# Altium project Apalis Evaluation Board.PrjPCB (part 4 of 5)

## Sheet USB_Connectors.SchDoc: Apalis Evaluation Board 1.1
size A3; Organization: Toradex AG; Address1: Altsagenstrasse 5; Address2: Horw; Address3: 6048; Address4: Switzerland; DocumentNumber: 7; Revision: V1.1; SheetNumber: 7; SheetTotal: 32; PageSetup: Record=PageOptions|CenterHorizontal=True|CenterVertical=True|PrintScale=0.71|XCorrection=1.00|YCorrection=1.00|PrintKind=0|BorderSize=5000000|LeftOffset=0|BottomOffset=0|Orientation=2|PaperLength=1000|PaperWidth=1000|Scale=100|PaperSource=7|PrintQuality=-4|MediaType=1|DitherType=10|PaperKind=A4|PrintScaleMode=1
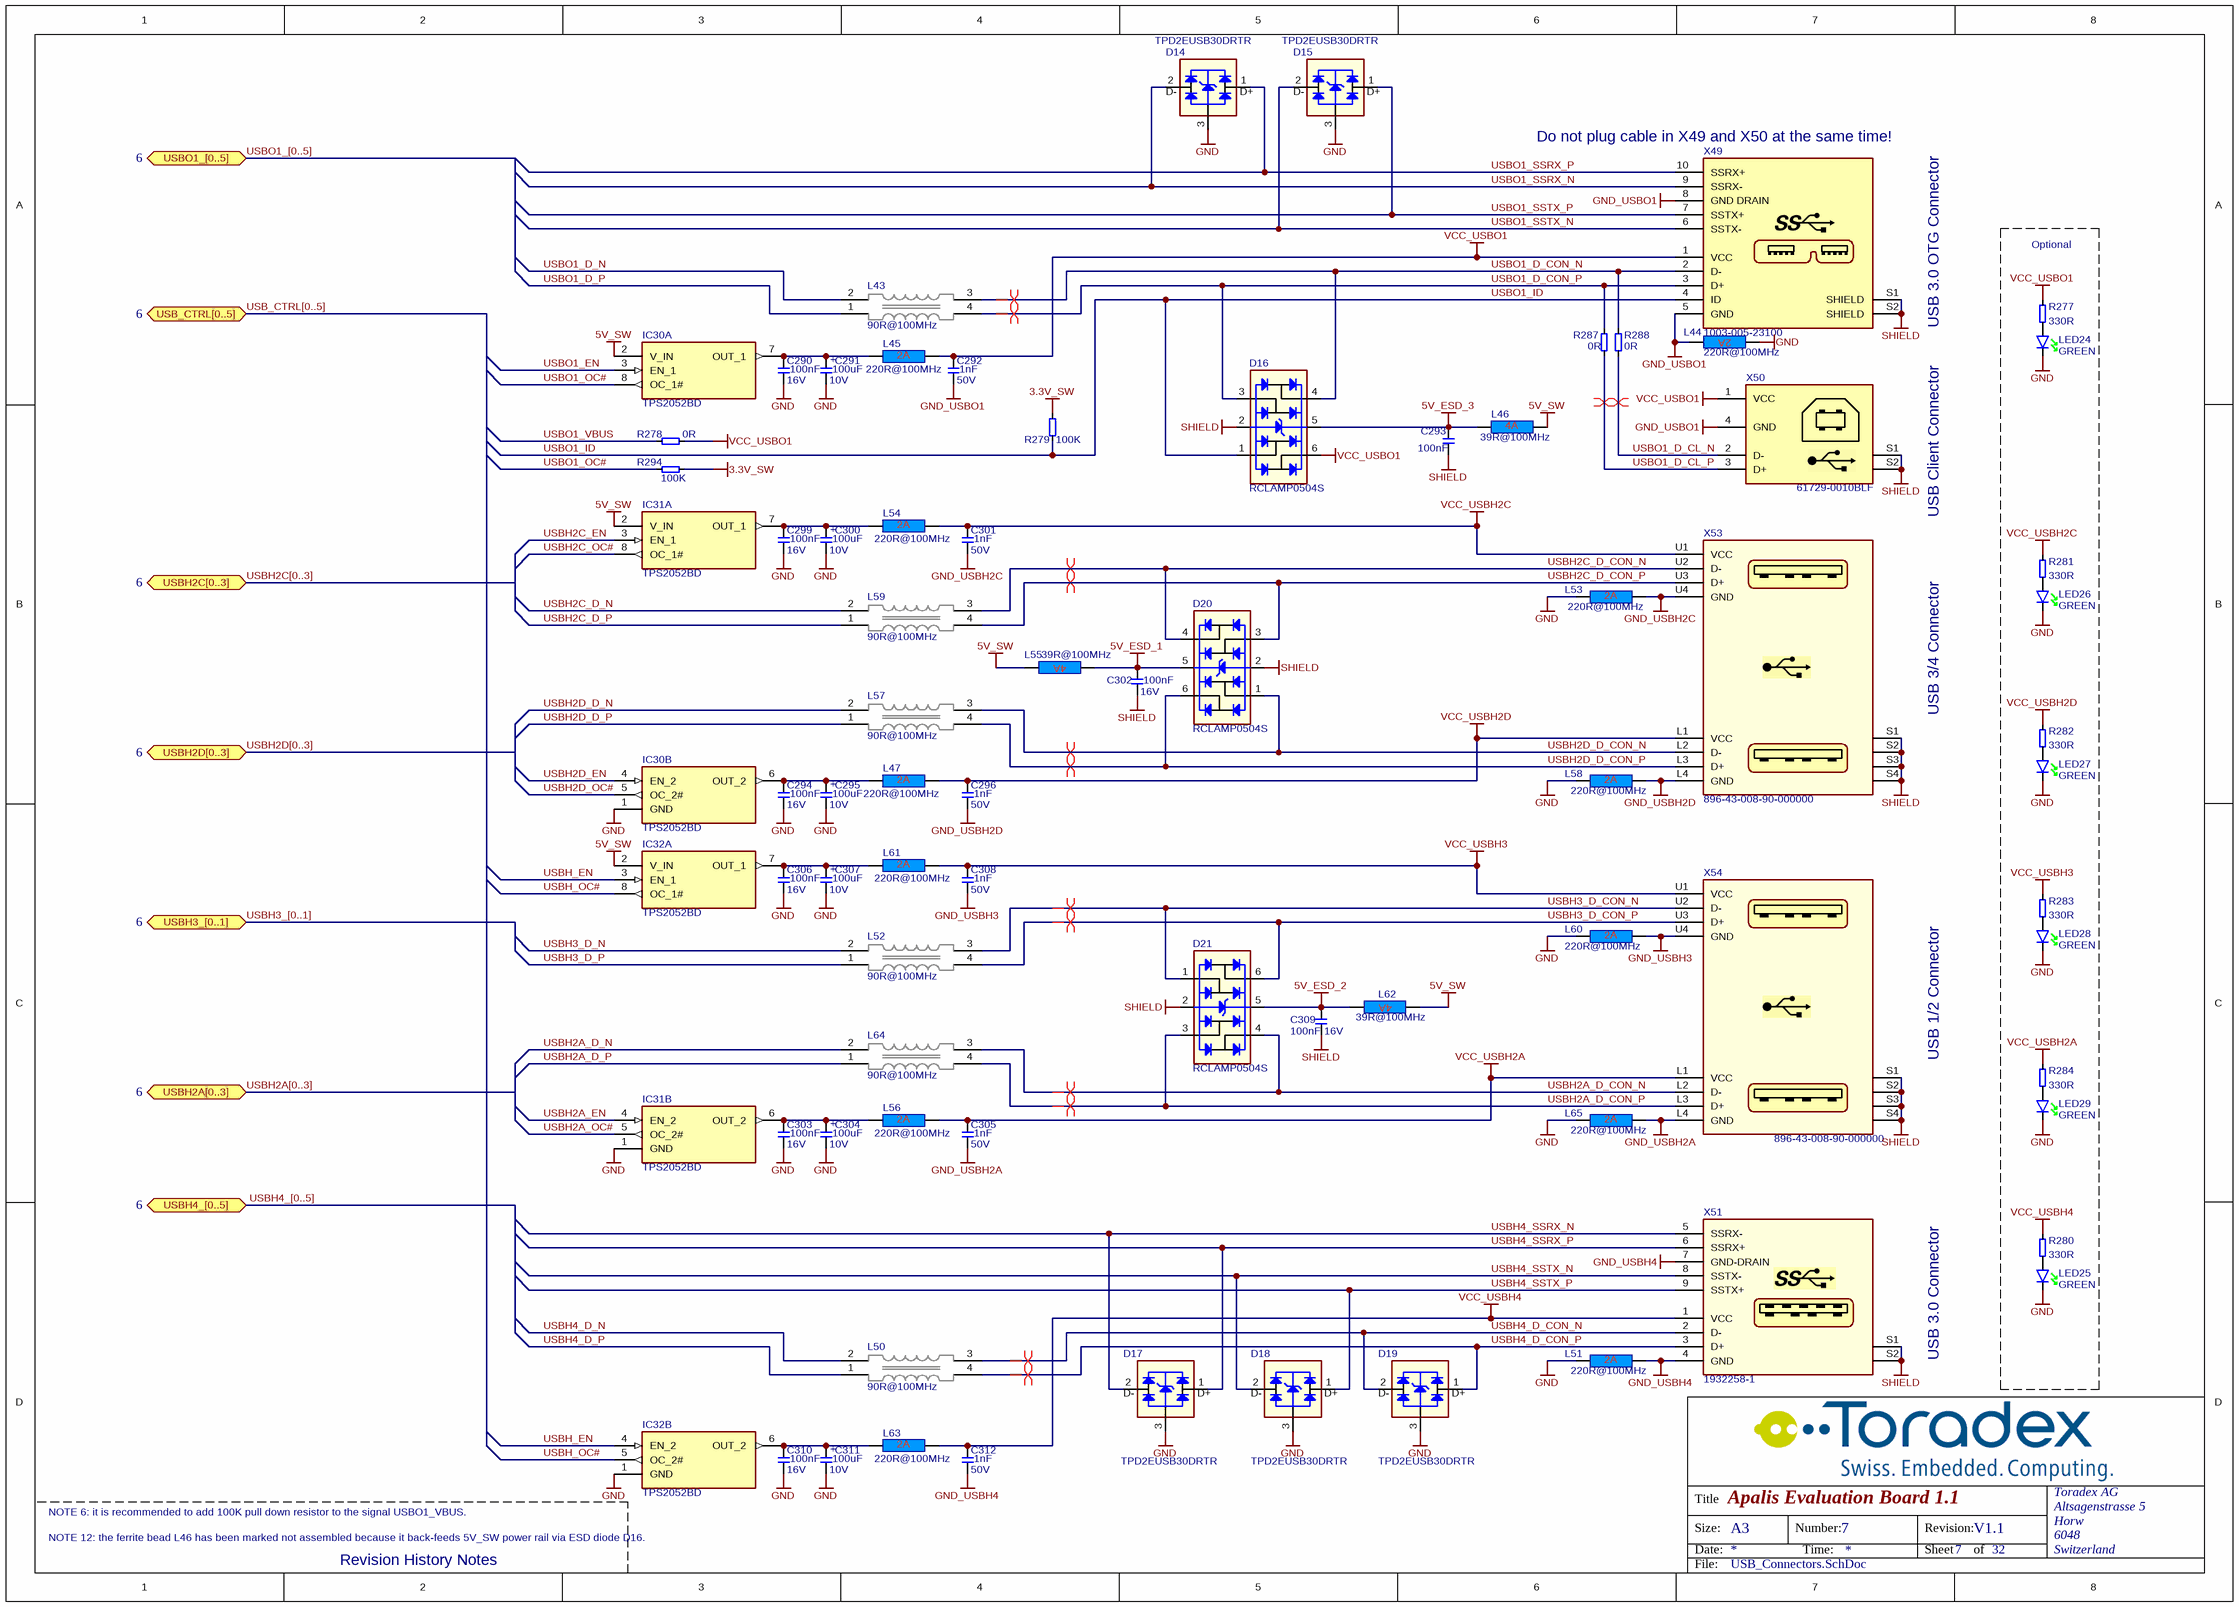
[diagram p21: USB_Connectors.SchDoc]

### Parts
C290  Rating: 16V  [T_CAPC0603X33N]  (hidden comment: 100nF)
C291  Rating: 10V  [CAPMP6032X280N]  (hidden comment: 100uF)
C292  Rating: 50V  [T_CAPC0603X33N]  (hidden comment: 1nF)
C293  100nF  [T_CAPC0603X33N]
C294  Rating: 16V  [T_CAPC0603X33N]  (hidden comment: 100nF)
C295  Rating: 10V  [CAPMP6032X280N]  (hidden comment: 100uF)
C296  Rating: 50V  [T_CAPC0603X33N]  (hidden comment: 1nF)
C299  Rating: 16V  [T_CAPC0603X33N]  (hidden comment: 100nF)
C300  Rating: 10V  [CAPMP6032X280N]  (hidden comment: 100uF)
C301  Rating: 50V  [T_CAPC0603X33N]  (hidden comment: 1nF)
C302  Rating: 16V  [T_CAPC0603X33N]  (hidden comment: 100nF)
C303  Rating: 16V  [T_CAPC0603X33N]  (hidden comment: 100nF)
C304  Rating: 10V  [CAPMP6032X280N]  (hidden comment: 100uF)
C305  Rating: 50V  [T_CAPC0603X33N]  (hidden comment: 1nF)
C306  Rating: 16V  [T_CAPC0603X33N]  (hidden comment: 100nF)
C307  Rating: 10V  [CAPMP6032X280N]  (hidden comment: 100uF)
C308  Rating: 50V  [T_CAPC0603X33N]  (hidden comment: 1nF)
C309  Rating: 16V  [T_CAPC0603X33N]  (hidden comment: 100nF)
C310  Rating: 16V  [T_CAPC0603X33N]  (hidden comment: 100nF)
C311  Rating: 10V  [CAPMP6032X280N]  (hidden comment: 100uF)
C312  Rating: 50V  [T_CAPC0603X33N]  (hidden comment: 1nF)
D14  TPD2EUSB30DRTR  [T_TI_TPD2EUSB30DRTR]
D15  TPD2EUSB30DRTR  [T_TI_TPD2EUSB30DRTR]
D16  RCLAMP0504S  [T_SOT95P285X90-6N]
D17  TPD2EUSB30DRTR  [T_TI_TPD2EUSB30DRTR]
D18  TPD2EUSB30DRTR  [T_TI_TPD2EUSB30DRTR]
D19  TPD2EUSB30DRTR  [T_TI_TPD2EUSB30DRTR]
D20  RCLAMP0504S  [T_SOT95P285X90-6N]
D21  RCLAMP0504S  [T_SOT95P285X90-6N]
IC30  TPS2052BD  [SOIC127P600X173-8N]  (parts A,B of 2)
IC31  TPS2052BD  [SOIC127P600X173-8N]  (parts A,B of 2)
IC32  TPS2052BD  [SOIC127P600X173-8N]  (parts A,B of 2)
L43  90R@100MHz  [T_Murata_DLW21SN900SQ2]
L44  220R@100MHz  [INDC1608X95N]
L45  220R@100MHz  [INDC1608X95N]
L46  39R@100MHz  [INDC2013X130N]
L47  220R@100MHz  [INDC1608X95N]
L50  90R@100MHz  [T_Murata_DLW21SN900SQ2]
L51  220R@100MHz  [INDC1608X95N]
L52  90R@100MHz  [T_Murata_DLW21SN900SQ2]
L53  220R@100MHz  [INDC1608X95N]
L54  220R@100MHz  [INDC1608X95N]
L55  39R@100MHz  [INDC2013X130N]
L56  220R@100MHz  [INDC1608X95N]
L57  90R@100MHz  [T_Murata_DLW21SN900SQ2]
L58  220R@100MHz  [INDC1608X95N]
L59  90R@100MHz  [T_Murata_DLW21SN900SQ2]
L60  220R@100MHz  [INDC1608X95N]
L61  220R@100MHz  [INDC1608X95N]
L62  39R@100MHz  [INDC2013X130N]
L63  220R@100MHz  [INDC1608X95N]
L64  90R@100MHz  [T_Murata_DLW21SN900SQ2]
L65  220R@100MHz  [INDC1608X95N]
LED24  Color: GREEN  [T_Osram_T670_GREEN]  (hidden comment: LG T670-K1L2-1)
LED25  Color: GREEN  [T_Osram_T670_GREEN]  (hidden comment: LG T670-K1L2-1)
LED26  Color: GREEN  [T_Osram_T670_GREEN]  (hidden comment: LG T670-K1L2-1)
LED27  Color: GREEN  [T_Osram_T670_GREEN]  (hidden comment: LG T670-K1L2-1)
LED28  Color: GREEN  [T_Osram_T670_GREEN]  (hidden comment: LG T670-K1L2-1)
LED29  Color: GREEN  [T_Osram_T670_GREEN]  (hidden comment: LG T670-K1L2-1)
R277  330R  [T_RESC0603X30N]
R278  0R  [T_RESC0603X30N]
R279  100K  [t_RESC0603X30N]
R280  330R  [T_RESC0603X30N]
R281  330R  [T_RESC0603X30N]
R282  330R  [T_RESC0603X30N]
R283  330R  [T_RESC0603X30N]
R284  330R  [T_RESC0603X30N]
R287  0R  [RESC1005X40N]
R288  0R  [RESC1005X40N]
R294  100K  [t_RESC0603X30N]
X49  1003-005-23100  [T_Cnc_1003-005-23100]
X50  61729-0010BLF  [T_FCI_61729-0010BLF]
X51  1932258-1  [T_TE_1932258-1]
X53  896-43-008-90-000000  [T_MMMC_896-43-008-90-000000]
X54  896-43-008-90-000000  [T_MMMC_896-43-008-90-000000]

### Blocks framed on the sheet
Optional: LED24-LED29 R277 R280-R284

### Ports
USB_CTRL[0..5] (bidir, see 6), USBH2A[0..3] (bidir, see 6), USBH2C[0..3] (bidir, see 6), USBH2D[0..3] (bidir, see 6), USBH3_[0..1] (bidir, see 6), USBH4_[0..5] (bidir, see 6), USBO1_[0..5] (bidir, see 6)

### Nets
3.3V_SW: R279.1 R294.2
5V_ESD_1: C302.2 D20.5 L55.1
5V_ESD_2: C309.2 D21.5 L62.2
5V_ESD_3: C293.2 D16.5 L46.1
5V_SW: IC30.2(V_IN) IC31.2(V_IN) IC32.2(V_IN) L46.2 L55.2 L62.1
GND: C290.1 C291.2 C294.1 C295.2 C299.1 C300.2 C303.1 C304.2 C306.1 C307.2 C310.1 C311.2 D14.3 D15.3 D17.3 D18.3 D19.3 IC30.1(GND) IC31.1(GND) IC32.1(GND) L44.1 L51.1 L53.1 L58.1 L60.1 L65.1 LED24.K LED25.K LED26.K LED27.K LED28.K LED29.K
GND_USBH2A: C305.1 L65.2 X54.L4(GND)
GND_USBH2C: C301.1 L53.2 X53.U4(GND)
GND_USBH2D: C296.1 L58.2 X53.L4(GND)
GND_USBH3: C308.1 L60.2 X54.U4(GND)
GND_USBH4: C312.1 L51.2 X51.4(GND) X51.7(GND-DRAIN)
GND_USBO1: C292.1 L44.2 X49.5(GND) X49.8(GND_DRAIN) X50.4(GND)
SHIELD: C293.1 C302.1 C309.1 D16.2 D20.2 D21.2 X49.S1(SHIELD) X49.S2(SHIELD) X50.S1 X50.S2 X51.S1(SHIELD) X51.S2(SHIELD) X53.S1(SHIELD) X53.S2(SHIELD) X53.S3(SHIELD) X53.S4(SHIELD) X54.S1(SHIELD) X54.S2(SHIELD) X54.S3(SHIELD) X54.S4(SHIELD)
VCC_USBH2A: C305.2 L56.2 R284.2 X54.L1(VCC)
VCC_USBH2C: C301.2 L54.2 R281.2 X53.U1(VCC)
VCC_USBH2D: C296.2 L47.2 R282.2 X53.L1(VCC)
VCC_USBH3: C308.2 L61.2 R283.2 X54.U1(VCC)
VCC_USBH4: C312.2 L63.2 R280.2 X51.1(VCC)
VCC_USBO1: C292.2 D16.6 L45.2 R277.2 R278.2 X49.1(VCC) X50.1(VCC)
USBH2A_D_CON_N: D21.4 L64.3 X54.L2(D-)
USBH2A_D_CON_P: D21.3 L64.4 X54.L3(D+)
USBH2A_D_N: L64.2
USBH2A_D_P: L64.1
USBH2A_EN: IC31.4(EN_2)
USBH2A_OC#: IC31.5(OC_2#)
USBH2C_D_CON_N: D20.4 L59.3 X53.U2(D-)
USBH2C_D_CON_P: D20.3 L59.4 X53.U3(D+)
USBH2C_D_N: L59.2
USBH2C_D_P: L59.1
USBH2C_EN: IC31.3(EN_1)
USBH2C_OC#: IC31.8(OC_1#)
USBH2D_D_CON_N: D20.1 L57.3 X53.L2(D-)
USBH2D_D_CON_P: D20.6 L57.4 X53.L3(D+)
USBH2D_D_N: L57.2
USBH2D_D_P: L57.1
USBH2D_EN: IC30.4(EN_2)
USBH2D_OC#: IC30.5(OC_2#)
USBH3_D_CON_N: D21.1 L52.3 X54.U2(D-)
USBH3_D_CON_P: D21.6 L52.4 X54.U3(D+)
USBH3_D_N: L52.2
USBH3_D_P: L52.1
USBH4_D_CON_N: D19.2(D-) L50.3 X51.2(D-)
USBH4_D_CON_P: D19.1(D+) L50.4 X51.3(D+)
USBH4_D_N: L50.2
USBH4_D_P: L50.1
USBH4_SSRX_N: D17.2(D-) X51.5(SSRX-)
USBH4_SSRX_P: D17.1(D+) X51.6(SSRX+)
USBH4_SSTX_N: D18.2(D-) X51.8(SSTX-)
USBH4_SSTX_P: D18.1(D+) X51.9(SSTX+)
USBH_EN: IC32.3(EN_1) IC32.4(EN_2)
USBH_OC#: IC32.5(OC_2#) IC32.8(OC_1#)
USBO1_D_CL_N: R288.1 X50.2(D-)
USBO1_D_CL_P: R287.1 X50.3(D+)
USBO1_D_CON_N: D16.4 L43.3 R288.2 X49.2(D-)
USBO1_D_CON_P: D16.3 L43.4 R287.2 X49.3(D+)
USBO1_D_N: L43.2
USBO1_D_P: L43.1
USBO1_EN: IC30.3(EN_1)
USBO1_ID: D16.1 R279.2 X49.4(ID)
USBO1_OC#: IC30.8(OC_1#) R294.1
USBO1_SSRX_N: D14.2(D-) X49.9(SSRX-)
USBO1_SSRX_P: D14.1(D+) X49.10(SSRX+)
USBO1_SSTX_N: D15.2(D-) X49.6(SSTX-)
USBO1_SSTX_P: D15.1(D+) X49.7(SSTX+)
USBO1_VBUS: R278.1
NetC290_2: C290.2 C291.1 IC30.7(OUT_1) L45.1
NetC294_2: C294.2 C295.1 IC30.6(OUT_2) L47.1
NetC299_2: C299.2 C300.1 IC31.7(OUT_1) L54.1
NetC303_2: C303.2 C304.1 IC31.6(OUT_2) L56.1
NetC306_2: C306.2 C307.1 IC32.7(OUT_1) L61.1
NetC310_2: C310.2 C311.1 IC32.6(OUT_2) L63.1
NetLED24_A: LED24.A R277.1
NetLED25_A: LED25.A R280.1
NetLED26_A: LED26.A R281.1
NetLED27_A: LED27.A R282.1
NetLED28_A: LED28.A R283.1
NetLED29_A: LED29.A R284.1

### Buses and harness runs
bus USB_CTRL[0..5] = port USB_CTRL[0..5]
bus USBH2A[0..3] = port USBH2A[0..3]
bus USBH2C[0..3] = port USBH2C[0..3]
bus USBH2D[0..3] = port USBH2D[0..3]
bus USBH3_[0..1] = port USBH3_[0..1]
bus USBH4_[0..5] = port USBH4_[0..5]
bus USBO1_[0..5] = port USBO1_[0..5]

### Layout directives
differential pair: USBH2A_D_CON_N, USBH2A_D_CON_P, USBH2C_D_CON_N, USBH2C_D_CON_P, USBH2D_D_CON_N, USBH2D_D_CON_P, USBH3_D_CON_N, USBH3_D_CON_P, USBH4_D_CON_N, USBH4_D_CON_P, USBO1_D_CL_N, USBO1_D_CL_P, USBO1_D_CON_N, USBO1_D_CON_P

### Notes on the sheet
- (near X49) Do not plug cable in X49 and X50 at the same time!
- (near X49) USB 3.0 OTG Connector
- USB Client Connector
- (near X53) USB 3/4 Connector
- (near X54) USB 1/2 Connector
- (near X51) USB 3.0 Connector
- NOTE 6: it is recommended to add 100K pull down resistor to the signal USBO1_VBUS.
- NOTE 12: the ferrite bead L46 has been marked not assembled because it back-feeds 5V_SW power rail via ESD diode D16.
- Revision History Notes
- Title
- Size:
- Date:
- A3
- Number:
- Time:
- Revision:
- Sheet
- of
- File:
- (in symbol C-TA-100uF-10V-10%-6032) +

### Library data of the parts
C290 C293 C294 C299 C302 C303 C306 C309 C310 = C-X7R-100nF-16V-10%-0603: Capacitor Ceramic X7R 100nF 16V 10% 0603; Tolerance: 10%; Type: X7R; Value: 100nF
C291 C295 C300 C304 C307 C311 = C-TA-100uF-10V-10%-6032: Capacitor TA 100uF 10V 10% 6032; Tolerance: 10%; Type: TA; Value: 100uF
C292 C296 C301 C305 C308 C312 = C-X7R-1nF-50V-10%-0603: Capacitor Ceramic X7R 1nF 50V 10% 0603; Tolerance: 10%; Type: X7R; Value: 1nF
D14 D15 D17-D19 = D-TI-TPD2EUSB30DRTR: 2 Channel Protection for Super Speed USB3.0; Manufacturer Name: TI; Manufacturer Part No.: TPD2EUSB30DRTR
D16 D20 D21 = D-Semtech-RClamp0504S: TVS Array low cap; Manufacturer Name: Semtech; Manufacturer Part No.: RCLAMP0504S
IC30-IC32 = IC-TI-TPS2052BD: Dual High Side Switch With OC_DET 500mA/CH; Manufacturer Name: Texas Instruments; Manufacturer Part No.: TPS2052BD
L43 L50 L52 L57 L59 L64 = L-Murata-DLW21SN900SQ2-90R@100MHz-330mA-25%: Common Mode Choke High Speed 90R 330mA; Manufacturer Name: Murata; Tolerance: 25%; Rating: 330mA; Manufacturer Part No.: DLW21SN900SQ2; Value: 90R@100MHz
L44 L45 L47 L51 L53 L54 L56 L58 L60 L61 L63 L65 = L-220R@100MHz-2A-25%-0603: as L13-L15 on sheet RGB_Displays; Rating: 2A; Value: 220R@100MHz
L46 L55 L62 = L-Panasonic-EXC-ML20A390U-39R@100MHz-4A-25%-0805: 39R@100MHz 4A EMI FILTER; Tolerance: 25%; Rating: 4A; Manufacturer Name: Panasonic; Manufacturer Name: EXC-ML20A390U; Value: 39R@100MHz
LED24-LED29 = LED-Osram-T670-K1L2-1: LED green Osram LG T670-K1L2-1; Manufacturer Name: Osram; Manufacturer Part No.: LG T670-K1L2-1
R277 R280-R284 = R-330R-63mW-5%-0603: Resistor 330 ohm 63mW 5% 0603; Rating: 63mW; Tolerance: 5%; Value: 330R
R278 = R-0R-63mW-1%-0603: Resistor 0 ohm 63mW 1% 0603; Rating: 63mW; Tolerance: 1%; Value: 0R
R279 R294 = R-100KR-63mW-5%-0603: as R177 on sheet RTC; Rating: 63mW; Tolerance: 5%
R287 R288 = R-0R-63mW-1%-0402: Resistor 0 ohm 63mW 1% 0402; Rating: 63mW; Tolerance: 1%; Value: 0R
X49 = CON-CnC-1003-005-23100: Micro USB AB 3.0 Connector; Manufacturer Name: CnC Tech.; No. of ways: 10; Manufacturer Part No.: 1003-005-23100
X50 = CON-FCI-61729-0010BLF: USB Type B Connector; Manufacturer Name: FCI; No. of ways: 4; Manufacturer Part No.: 61729-0010BLF
X51 = CON-TECon-1932258-1: USB 3.0, Type A; Manufacturer Name: TE Connectivity; No. of ways: 9; Manufacturer Part No.: 1932258-1
X53 X54 = CON-MMMC-896-43-008-90-000000: USB 2.0 double row, Type A; Manufacturer Name: Mill-Max Mfg. Corp.; No. of ways: 8; Manufacturer Part No.: 896-43-008-90-000000

## Sheet USB_Hub.SchDoc: Apalis Evaluation Board 1.1
size A3; Organization: Toradex AG; Address1: Altsagenstrasse 5; Address2: Horw; Address3: 6048; Address4: Switzerland; DocumentNumber: 6; Revision: V1.1; SheetNumber: 6; SheetTotal: 32; PageSetup: Record=PageOptions|CenterHorizontal=True|CenterVertical=True|PrintScale=0.71|XCorrection=1.00|YCorrection=1.00|PrintKind=0|BorderSize=5000000|LeftOffset=0|BottomOffset=0|Orientation=2|PaperLength=1000|PaperWidth=1000|Scale=100|PaperSource=7|PrintQuality=-4|MediaType=1|DitherType=10|PaperKind=A4|PrintScaleMode=1
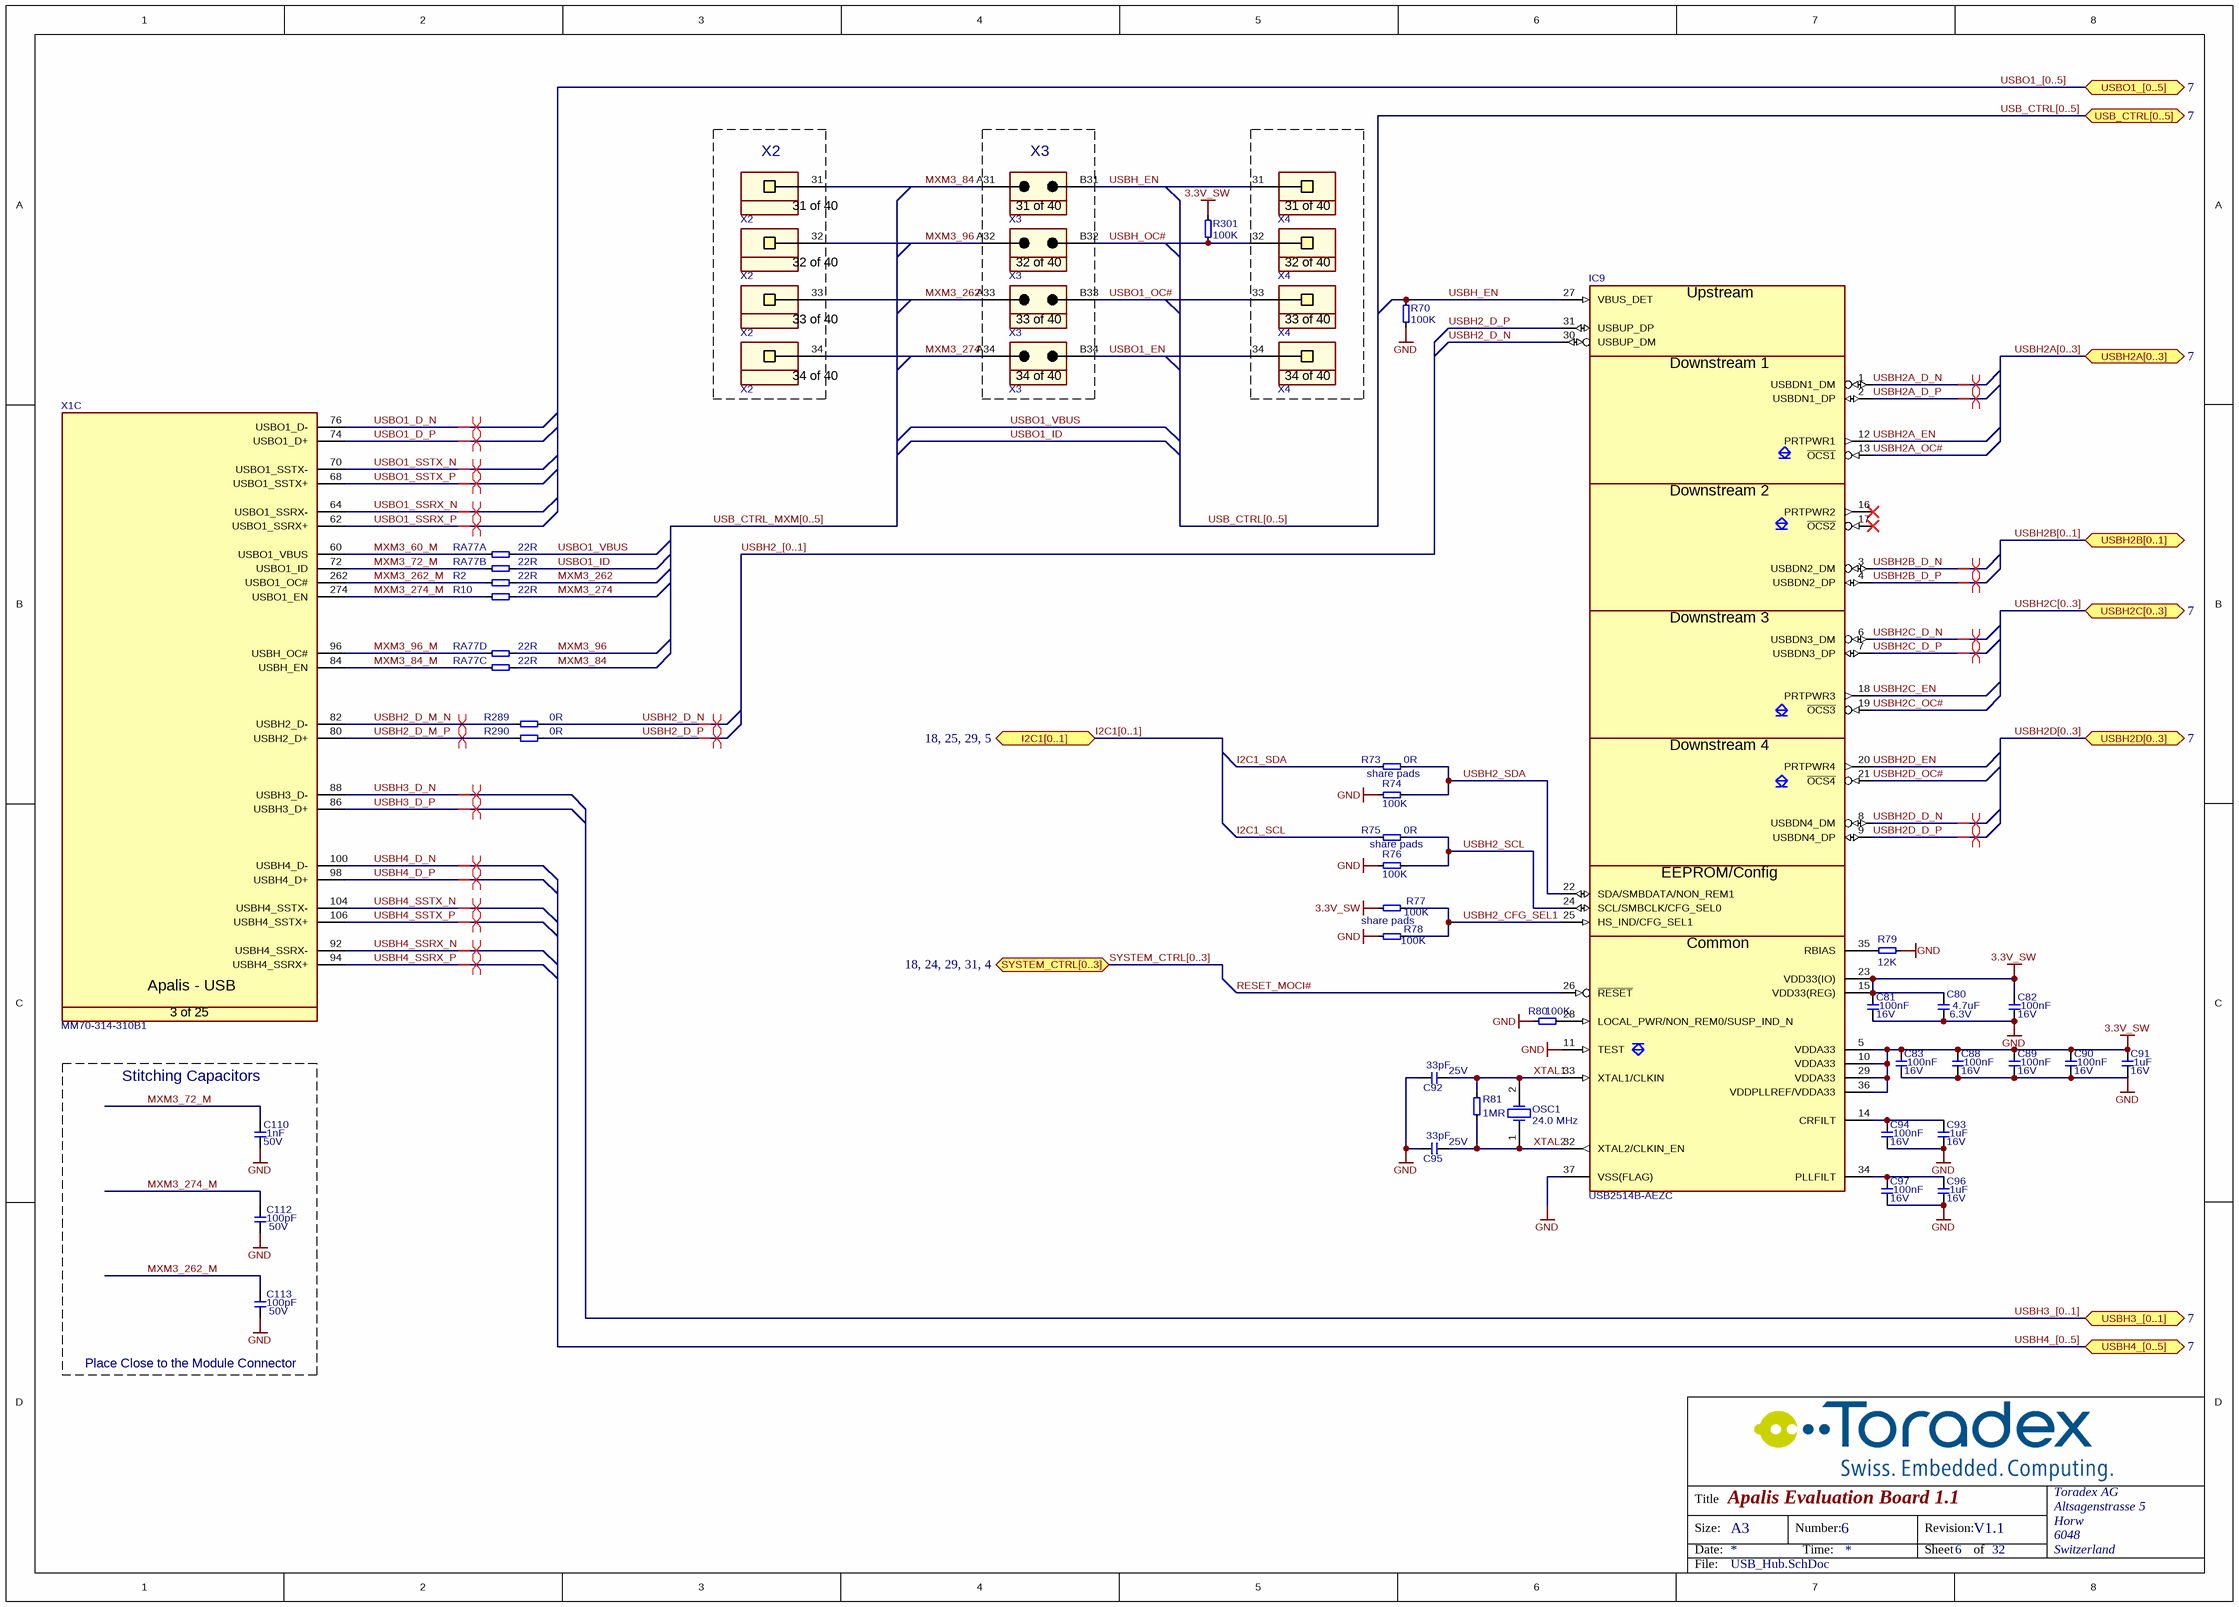
[diagram p22: USB_Hub.SchDoc]

### Parts
C80  Rating: 6.3V  [T_CAPC0603X33N]  (hidden comment: 4.7uF)
C81  Rating: 16V  [T_CAPC0603X33N]  (hidden comment: 100nF)
C82  Rating: 16V  [T_CAPC0603X33N]  (hidden comment: 100nF)
C83  Rating: 16V  [T_CAPC0603X33N]  (hidden comment: 100nF)
C88  Rating: 16V  [T_CAPC0603X33N]  (hidden comment: 100nF)
C89  Rating: 16V  [T_CAPC0603X33N]  (hidden comment: 100nF)
C90  Rating: 16V  [T_CAPC0603X33N]  (hidden comment: 100nF)
C91  Rating: 16V  [T_CAPC0603X33N]  (hidden comment: 1uF)
C92  Rating: 25V  [T_CAPC0603X33N]  (hidden comment: 33pF)
C93  Rating: 16V  [T_CAPC0603X33N]  (hidden comment: 1uF)
C94  Rating: 16V  [T_CAPC0603X33N]  (hidden comment: 100nF)
C95  Rating: 25V  [T_CAPC0603X33N]  (hidden comment: 33pF)
C96  Rating: 16V  [T_CAPC0603X33N]  (hidden comment: 1uF)
C97  Rating: 16V  [T_CAPC0603X33N]  (hidden comment: 100nF)
C110  Rating: 50V  [CAPC1005X60N]  (hidden comment: 1nF)
C112  Rating: 50V  [CAPC1005X60N]  (hidden comment: 100pF)
C113  Rating: 50V  [CAPC1005X60N]  (hidden comment: 100pF)
IC9  Manufacturer Part No.: USB2514B-AEZC  [T_SMSC_USB2514B-AEZC]  (hidden comment: USB2514B)
OSC1  value 24.0 MHz  [T_HORIZON-HEX24]  (hidden comment: HEX24-24000MHz-18-50R-F-H2-T2-W2-T)
R2  22R  [RESC1005X40N]
R10  22R  [RESC1005X40N]
R70  100K  [T_RESC0603X30N]
R73  0R  [T_RESC0603X30N]
R74  100K  [T_RESC0603X30N]
R75  0R  [T_RESC0603X30N]
R76  100K  [T_RESC0603X30N]
R77  100K  [T_RESC0603X30N]
R78  100K  [T_RESC0603X30N]
R79  12K  [T_RESC0603X30N]
R80  100K  [T_RESC0603X30N]
R81  1MR  [T_RESC0603X30N]
R289  0R  [RESC1005X40N]
R290  0R  [RESC1005X40N]
R301  100K  [T_RESC0603X30N]
RA77  22R  [T_Resistor_Array_X4]  (parts A,B,C,D of 4)
X1  Manufacturer Part No.: MM70-314-310B1  [T_JAE_MM70-314-310B1]  (hidden comment: CON-JAE-MM70-314-310B1-314-0.5mm)  (part C of 25)
X2  SSW-110-01-G-S  [T_Samtec_SSW-110-01-G-S]  (value not drawn)  (parts 31,32,33,34 of 40)
X3  TSW-110-07-G-D  [T_Samtec_TSW-110-07-G-D]  (value not drawn)  (parts 31,32,33,34 of 40)
X4  SSW-110-01-G-S  [T_Samtec_SSW-110-01-G-S]  (value not drawn)  (parts 31,32,33,34 of 40)

### Blocks framed on the sheet
X2: X2
X3: X3
Stitching Capacitors: C110 C112 C113

### Ports
I2C1[0..1] (bidir, see 18, 25, 29, 5), SYSTEM_CTRL[0..3] (bidir, see 18, 24, 29, 31, 4), USB_CTRL[0..5] (bidir, see 7), USBH2A[0..3] (bidir, see 7), USBH2B[0..1] (bidir), USBH2C[0..3] (bidir, see 7), USBH2D[0..3] (bidir, see 7), USBH3_[0..1] (bidir, see 7), USBH4_[0..5] (bidir, see 7), USBO1_[0..5] (bidir, see 7)

### Nets
3.3V_SW: C80.2 C81.2 C82.2 C83.2 C88.2 C89.2 C90.2 C91.2 IC9.5(VDDA33) IC9.10(VDDA33) IC9.15(VDD33(REG)) IC9.23(VDD33(IO)) IC9.29(VDDA33) IC9.36(VDDPLLREF/VDDA33) R77.2 R301.1
GND: C80.1 C81.1 C82.1 C83.1 C88.1 C89.1 C90.1 C91.1 C92.1 C93.1 C94.1 C95.1 C96.1 C97.1 C110.1 C112.1 C113.1 IC9.11(TEST) IC9.37(VSS(FLAG)) R70.1 R74.2 R76.2 R78.2 R79.1 R80.1
I2C1_SCL: R75.1
I2C1_SDA: R73.1
MXM3_60_M: RA77.1 X1.60(USBO1_VBUS)
MXM3_72_M: C110.2 RA77.2 X1.72(USBO1_ID)
MXM3_84: RA77.7 X2.31 X3.A31
MXM3_84_M: RA77.3 X1.84(USBH_EN)
MXM3_96: RA77.8 X2.32 X3.A32
MXM3_96_M: RA77.4 X1.96(USBH_OC#)
MXM3_262: R2.2 X2.33 X3.A33
MXM3_262_M: C113.2 R2.1 X1.262(USBO1_OC#)
MXM3_274: R10.2 X2.34 X3.A34
MXM3_274_M: C112.2 R10.1 X1.274(USBO1_EN)
RESET_MOCI#: IC9.26(~{RESET})
USBH2_CFG_SEL1: IC9.25(HS_IND/CFG_SEL1) R77.1 R78.1
USBH2_D_M_N: R289.1 X1.82(USBH2_D-)
USBH2_D_M_P: R290.1 X1.80(USBH2_D+)
USBH2_D_N: IC9.30(USBUP_DM) R289.2
USBH2_D_P: IC9.31(USBUP_DP) R290.2
USBH2_SCL: IC9.24(SCL/SMBCLK/CFG_SEL0) R75.2 R76.1
USBH2_SDA: IC9.22(SDA/SMBDATA/NON_REM1) R73.2 R74.1
USBH2A_D_N: IC9.1(USBDN1_DM)
USBH2A_D_P: IC9.2(USBDN1_DP)
USBH2A_EN: IC9.12(PRTPWR1)
USBH2A_OC#: IC9.13(~{OCS1})
USBH2B_D_N: IC9.3(USBDN2_DM)
USBH2B_D_P: IC9.4(USBDN2_DP)
USBH2C_D_N: IC9.6(USBDN3_DM)
USBH2C_D_P: IC9.7(USBDN3_DP)
USBH2C_EN: IC9.18(PRTPWR3)
USBH2C_OC#: IC9.19(~{OCS3})
USBH2D_D_N: IC9.8(USBDN4_DM)
USBH2D_D_P: IC9.9(USBDN4_DP)
USBH2D_EN: IC9.20(PRTPWR4)
USBH2D_OC#: IC9.21(~{OCS4})
USBH3_D_N: X1.88(USBH3_D-)
USBH3_D_P: X1.86(USBH3_D+)
USBH4_D_N: X1.100(USBH4_D-)
USBH4_D_P: X1.98(USBH4_D+)
USBH4_SSRX_N: X1.92(USBH4_SSRX-)
USBH4_SSRX_P: X1.94(USBH4_SSRX+)
USBH4_SSTX_N: X1.104(USBH4_SSTX-)
USBH4_SSTX_P: X1.106(USBH4_SSTX+)
USBH_EN: IC9.27(VBUS_DET) R70.2 X3.B31 X4.31
USBH_OC#: R301.2 X3.B32 X4.32
USBO1_D_N: X1.76(USBO1_D-)
USBO1_D_P: X1.74(USBO1_D+)
USBO1_EN: X3.B34 X4.34
USBO1_ID: RA77.6
USBO1_OC#: X3.B33 X4.33
USBO1_SSRX_N: X1.64(USBO1_SSRX-)
USBO1_SSRX_P: X1.62(USBO1_SSRX+)
USBO1_SSTX_N: X1.70(USBO1_SSTX-)
USBO1_SSTX_P: X1.68(USBO1_SSTX+)
USBO1_VBUS: RA77.5
XTAL1: C92.2 IC9.33(XTAL1/CLKIN) OSC1.2(OSC2) R81.2
XTAL2: C95.2 IC9.32(XTAL2/CLKIN_EN) OSC1.1(OSC1) R81.1
NetC93_2: C93.2 C94.2 IC9.14(CRFILT)
NetC96_2: C96.2 C97.2 IC9.34(PLLFILT)
NetIC9_28: IC9.28(LOCAL_PWR/NON_REM0/SUSP_IND_N) R80.2
NetIC9_35: IC9.35(RBIAS) R79.2

Not connected (* = marked no-connect by the designer): IC9 16(PRTPWR2)* 17(~{OCS2})*

### Buses and harness runs
bus I2C1[0..1] = port I2C1[0..1]
bus SYSTEM_CTRL[0..3] = port SYSTEM_CTRL[0..3]
bus USB_CTRL[0..5] = port USB_CTRL[0..5]
bus USB_CTRL_MXM[0..5]
bus USBH2_[0..1]
bus USBH2A[0..3] = port USBH2A[0..3]
bus USBH2B[0..1] = port USBH2B[0..1]
bus USBH2C[0..3] = port USBH2C[0..3]
bus USBH2D[0..3] = port USBH2D[0..3]
bus USBH3_[0..1] = port USBH3_[0..1]
bus USBH4_[0..5] = port USBH4_[0..5]
bus USBO1_[0..5] = port USBO1_[0..5]

### Layout directives
differential pair: USBH2_D_M_N, USBH2_D_M_P, USBH2_D_N, USBH2_D_P, USBH2A_D_N, USBH2A_D_P, USBH2B_D_N, USBH2B_D_P, USBH2C_D_N, USBH2C_D_P, USBH2D_D_N, USBH2D_D_P, USBH3_D_N, USBH3_D_P, USBH4_D_N, USBH4_D_P, USBH4_SSRX_N, USBH4_SSRX_P, USBH4_SSTX_N, USBH4_SSTX_P, USBO1_D_N, USBO1_D_P, USBO1_SSRX_N, USBO1_SSRX_P, USBO1_SSTX_N, USBO1_SSTX_P

### Notes on the sheet
- (near R73) share pads
- (near R75) share pads
- share pads
- (near C113) Place Close to the Module Connector
- Title
- Size:
- Date:
- A3
- Number:
- Time:
- Revision:
- Sheet
- of
- File:
- (in symbol CON-JAE-MM70-314-310B1-314-0.5mm, part C) Apalis - USB; 3 of 25
- (in symbol CON-Samtec-SSW-110-01-G-S, part 31) 31 of 40
- (in symbol CON-Samtec-SSW-110-01-G-S, part 32) 32 of 40
- (in symbol CON-Samtec-SSW-110-01-G-S, part 33) 33 of 40
- (in symbol CON-Samtec-SSW-110-01-G-S, part 34) 34 of 40
- (in symbol CON-Samtec-TSW-110-07-G-D, part 31) 31 of 40
- (in symbol CON-Samtec-TSW-110-07-G-D, part 32) 32 of 40
- (in symbol CON-Samtec-TSW-110-07-G-D, part 33) 33 of 40
- (in symbol CON-Samtec-TSW-110-07-G-D, part 34) 34 of 40
- (in symbol IC-SMSC-USB2514B-AEZC) Upstream; Downstream 1; Downstream 2; Downstream 3; Downstream 4; EEPROM/Config; Common

### Library data of the parts
C80 = C-X5R-4.7uF-6.3V-20%-0603: Capacitor Ceramic X5R 4.7uF 6.3V 20% 0603; Tolerance: 20%; Type: X5R; Value: 4.7uF
C81-C83 C88-C90 C94 C97 = C-X7R-100nF-16V-10%-0603: Capacitor Ceramic X7R 100nF 16V 10% 0603; Tolerance: 10%; Type: X7R; Value: 100nF
C91 C93 C96 = C-X5R-1uF-16V-20%-0603: Capacitor Ceramic X5R 1uF 16V 20% 0603; Tolerance: 20%; Type: X5R; Value: 1uF
C92 C95 = C-NP0-33pF-25V-10%-0603: Capacitor Ceramic NP0 33pF 25V 10% 0603; Tolerance: 10%; Type: NP0; Value: 33pF
C110 = C-X7R-1nF-50V-10%-0402: Capacitor Ceramic X7R 1nF 50V 10% 0402; Tolerance: 10%; Type: X7R; Value: 1nF
C112 C113 = C-X7R-100pF-50V-10%-0402: Capacitor Ceramic X7R 100pF 50V 10% 0402; Tolerance: 10%; Type: X7R; Value: 100pF
IC9 = IC-SMSC-USB2514B-AEZC: 4 Port USB HUB; Manufacturer Name: SMSC
OSC1 = OSC-HORIZON-HEX24-24000MHz-18-50R-F-H2-T2-W2-T: Quartz 24.0 MHz; Tolerance: 30ppm; Manufacturer Name: HORIZON; Manufacturer Part No.: HEX24-24000MHz-18-50R-F-H2-T2-W2-T
R2 R10 = R-22R-63mW-5%-0402: Resistor 22 ohm 63mW 5% 0402; Rating: 63mW; Tolerance: 5%; Value: 22R
R70 R74 R76-R78 R80 R301 = R-100KR-63mW-5%-0603: as R177 on sheet RTC; Rating: 63mW; Tolerance: 5%
R73 R75 = R-0R-63mW-1%-0603: Resistor 0 ohm 63mW 1% 0603; Rating: 63mW; Tolerance: 1%; Value: 0R
R79 = R-12KR-63mW-1%-0603: Resistor 12 Kohm 63mW 1% 0603; Value: 12KR; Rating: 63mW; Tolerance: 1%
R81 = R-1MR-63mW-5%-0603: Resistor 1Mohm 63mW 5% 0603; Rating: 63mW; Tolerance: 5%; Value: 1MR
R289 R290 = R-0R-63mW-1%-0402: Resistor 0 ohm 63mW 1% 0402; Rating: 63mW; Tolerance: 1%; Value: 0R
RA77 = RA-22R-63mW-5%-1206-div: Resistor Array 22 R 63mW 5% 1206; Tolerance: 5%; Power Dissipation: 63mW; Value: 22R
X1 = CON-JAE-MM70-314-310B1-314-0.5mm: as X1 on sheet RGB_Displays
X2 X4 = CON-Samtec-SSW-110-01-G-S: as X8 on sheet RTC; Pitch: 2.54mm; No. of ways: 1x40; Manufacturer Part No.: SSW-110-01-G-S
X3 = CON-Samtec-TSW-110-07-G-D: as X9 on sheet RTC; Pitch: 2.54mm; No. of ways: 2x40; Manufacturer Part No.: TSW-110-07-G-D

## Sheet Mechanical.SchDoc: Apalis Evaluation Board 1.1
size A3; Organization: Toradex AG; Address1: Altsagenstrasse 5; Address2: Horw; Address3: 6048; Address4: Switzerland; DocumentNumber: 32; Revision: V1.1; SheetNumber: 32; SheetTotal: 32; PageSetup: Record=PageOptions|CenterHorizontal=True|CenterVertical=True|PrintScale=0.73|XCorrection=1.00|YCorrection=1.00|PrintKind=0|BorderSize=5000000|LeftOffset=0|BottomOffset=0|Orientation=2|PaperLength=1000|PaperWidth=1000|Scale=100|PaperSource=7|PrintQuality=-4|MediaType=1|DitherType=10|PaperKind=A4|PrintScaleMode=1
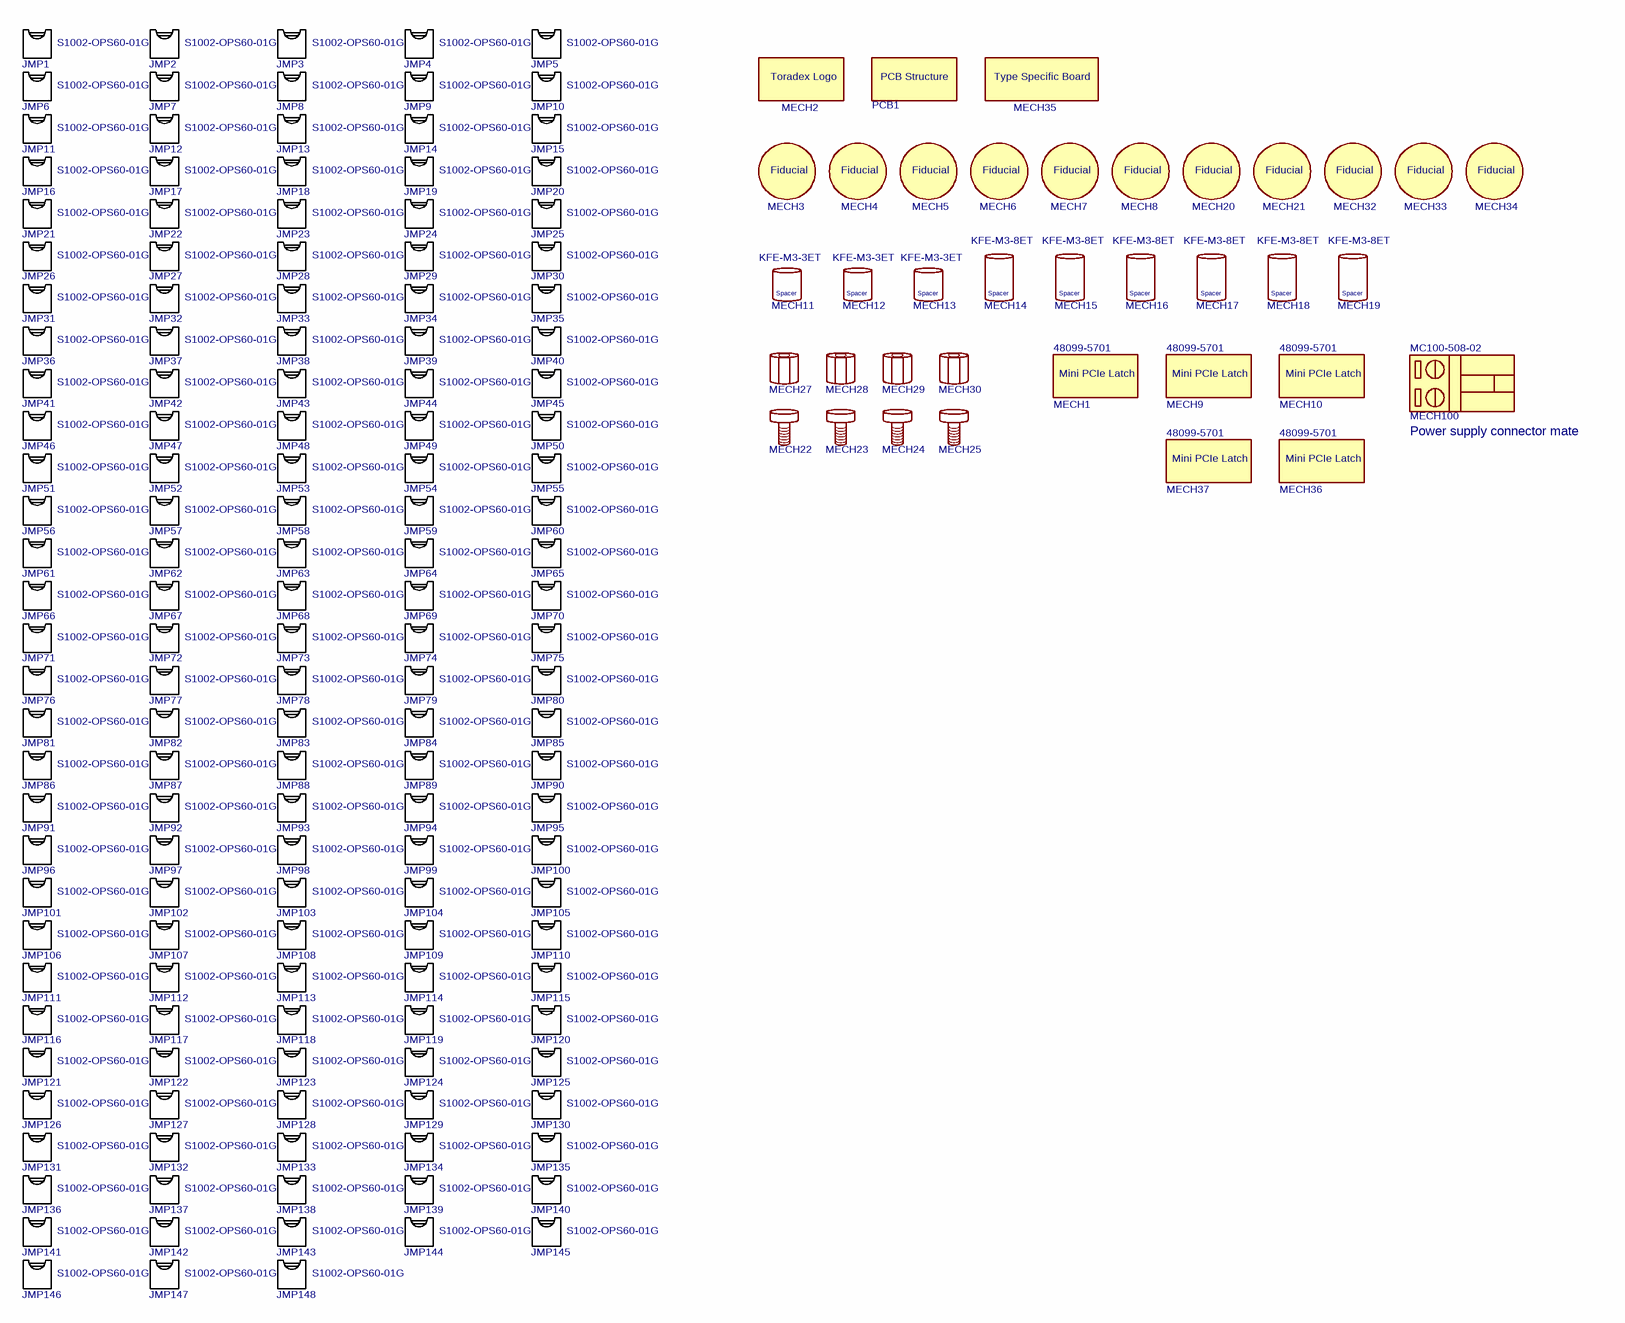
[diagram p23: Mechanical.SchDoc]

### Parts
JMP1  Manufacturer Part No.: S1002-OPS60-01G  (hidden comment: Shunt Jumper)
JMP2  Manufacturer Part No.: S1002-OPS60-01G  (hidden comment: Shunt Jumper)
JMP3  Manufacturer Part No.: S1002-OPS60-01G  (hidden comment: Shunt Jumper)
JMP4  Manufacturer Part No.: S1002-OPS60-01G  (hidden comment: Shunt Jumper)
JMP5  Manufacturer Part No.: S1002-OPS60-01G  (hidden comment: Shunt Jumper)
JMP6  Manufacturer Part No.: S1002-OPS60-01G  (hidden comment: Shunt Jumper)
JMP7  Manufacturer Part No.: S1002-OPS60-01G  (hidden comment: Shunt Jumper)
JMP8  Manufacturer Part No.: S1002-OPS60-01G  (hidden comment: Shunt Jumper)
JMP9  Manufacturer Part No.: S1002-OPS60-01G  (hidden comment: Shunt Jumper)
JMP10  Manufacturer Part No.: S1002-OPS60-01G  (hidden comment: Shunt Jumper)
JMP11  Manufacturer Part No.: S1002-OPS60-01G  (hidden comment: Shunt Jumper)
JMP12  Manufacturer Part No.: S1002-OPS60-01G  (hidden comment: Shunt Jumper)
JMP13  Manufacturer Part No.: S1002-OPS60-01G  (hidden comment: Shunt Jumper)
JMP14  Manufacturer Part No.: S1002-OPS60-01G  (hidden comment: Shunt Jumper)
JMP15  Manufacturer Part No.: S1002-OPS60-01G  (hidden comment: Shunt Jumper)
JMP16  Manufacturer Part No.: S1002-OPS60-01G  (hidden comment: Shunt Jumper)
JMP17  Manufacturer Part No.: S1002-OPS60-01G  (hidden comment: Shunt Jumper)
JMP18  Manufacturer Part No.: S1002-OPS60-01G  (hidden comment: Shunt Jumper)
JMP19  Manufacturer Part No.: S1002-OPS60-01G  (hidden comment: Shunt Jumper)
JMP20  Manufacturer Part No.: S1002-OPS60-01G  (hidden comment: Shunt Jumper)
JMP21  Manufacturer Part No.: S1002-OPS60-01G  (hidden comment: Shunt Jumper)
JMP22  Manufacturer Part No.: S1002-OPS60-01G  (hidden comment: Shunt Jumper)
JMP23  Manufacturer Part No.: S1002-OPS60-01G  (hidden comment: Shunt Jumper)
JMP24  Manufacturer Part No.: S1002-OPS60-01G  (hidden comment: Shunt Jumper)
JMP25  Manufacturer Part No.: S1002-OPS60-01G  (hidden comment: Shunt Jumper)
JMP26  Manufacturer Part No.: S1002-OPS60-01G  (hidden comment: Shunt Jumper)
JMP27  Manufacturer Part No.: S1002-OPS60-01G  (hidden comment: Shunt Jumper)
JMP28  Manufacturer Part No.: S1002-OPS60-01G  (hidden comment: Shunt Jumper)
JMP29  Manufacturer Part No.: S1002-OPS60-01G  (hidden comment: Shunt Jumper)
JMP30  Manufacturer Part No.: S1002-OPS60-01G  (hidden comment: Shunt Jumper)
JMP31  Manufacturer Part No.: S1002-OPS60-01G  (hidden comment: Shunt Jumper)
JMP32  Manufacturer Part No.: S1002-OPS60-01G  (hidden comment: Shunt Jumper)
JMP33  Manufacturer Part No.: S1002-OPS60-01G  (hidden comment: Shunt Jumper)
JMP34  Manufacturer Part No.: S1002-OPS60-01G  (hidden comment: Shunt Jumper)
JMP35  Manufacturer Part No.: S1002-OPS60-01G  (hidden comment: Shunt Jumper)
JMP36  Manufacturer Part No.: S1002-OPS60-01G  (hidden comment: Shunt Jumper)
JMP37  Manufacturer Part No.: S1002-OPS60-01G  (hidden comment: Shunt Jumper)
JMP38  Manufacturer Part No.: S1002-OPS60-01G  (hidden comment: Shunt Jumper)
JMP39  Manufacturer Part No.: S1002-OPS60-01G  (hidden comment: Shunt Jumper)
JMP40  Manufacturer Part No.: S1002-OPS60-01G  (hidden comment: Shunt Jumper)
JMP41  Manufacturer Part No.: S1002-OPS60-01G  (hidden comment: Shunt Jumper)
JMP42  Manufacturer Part No.: S1002-OPS60-01G  (hidden comment: Shunt Jumper)
JMP43  Manufacturer Part No.: S1002-OPS60-01G  (hidden comment: Shunt Jumper)
JMP44  Manufacturer Part No.: S1002-OPS60-01G  (hidden comment: Shunt Jumper)
JMP45  Manufacturer Part No.: S1002-OPS60-01G  (hidden comment: Shunt Jumper)
JMP46  Manufacturer Part No.: S1002-OPS60-01G  (hidden comment: Shunt Jumper)
JMP47  Manufacturer Part No.: S1002-OPS60-01G  (hidden comment: Shunt Jumper)
JMP48  Manufacturer Part No.: S1002-OPS60-01G  (hidden comment: Shunt Jumper)
JMP49  Manufacturer Part No.: S1002-OPS60-01G  (hidden comment: Shunt Jumper)
JMP50  Manufacturer Part No.: S1002-OPS60-01G  (hidden comment: Shunt Jumper)
JMP51  Manufacturer Part No.: S1002-OPS60-01G  (hidden comment: Shunt Jumper)
JMP52  Manufacturer Part No.: S1002-OPS60-01G  (hidden comment: Shunt Jumper)
JMP53  Manufacturer Part No.: S1002-OPS60-01G  (hidden comment: Shunt Jumper)
JMP54  Manufacturer Part No.: S1002-OPS60-01G  (hidden comment: Shunt Jumper)
JMP55  Manufacturer Part No.: S1002-OPS60-01G  (hidden comment: Shunt Jumper)
JMP56  Manufacturer Part No.: S1002-OPS60-01G  (hidden comment: Shunt Jumper)
JMP57  Manufacturer Part No.: S1002-OPS60-01G  (hidden comment: Shunt Jumper)
JMP58  Manufacturer Part No.: S1002-OPS60-01G  (hidden comment: Shunt Jumper)
JMP59  Manufacturer Part No.: S1002-OPS60-01G  (hidden comment: Shunt Jumper)
JMP60  Manufacturer Part No.: S1002-OPS60-01G  (hidden comment: Shunt Jumper)
JMP61  Manufacturer Part No.: S1002-OPS60-01G  (hidden comment: Shunt Jumper)
JMP62  Manufacturer Part No.: S1002-OPS60-01G  (hidden comment: Shunt Jumper)
JMP63  Manufacturer Part No.: S1002-OPS60-01G  (hidden comment: Shunt Jumper)
JMP64  Manufacturer Part No.: S1002-OPS60-01G  (hidden comment: Shunt Jumper)
JMP65  Manufacturer Part No.: S1002-OPS60-01G  (hidden comment: Shunt Jumper)
JMP66  Manufacturer Part No.: S1002-OPS60-01G  (hidden comment: Shunt Jumper)
JMP67  Manufacturer Part No.: S1002-OPS60-01G  (hidden comment: Shunt Jumper)
JMP68  Manufacturer Part No.: S1002-OPS60-01G  (hidden comment: Shunt Jumper)
JMP69  Manufacturer Part No.: S1002-OPS60-01G  (hidden comment: Shunt Jumper)
JMP70  Manufacturer Part No.: S1002-OPS60-01G  (hidden comment: Shunt Jumper)
JMP71  Manufacturer Part No.: S1002-OPS60-01G  (hidden comment: Shunt Jumper)
JMP72  Manufacturer Part No.: S1002-OPS60-01G  (hidden comment: Shunt Jumper)
JMP73  Manufacturer Part No.: S1002-OPS60-01G  (hidden comment: Shunt Jumper)
JMP74  Manufacturer Part No.: S1002-OPS60-01G  (hidden comment: Shunt Jumper)
JMP75  Manufacturer Part No.: S1002-OPS60-01G  (hidden comment: Shunt Jumper)
JMP76  Manufacturer Part No.: S1002-OPS60-01G  (hidden comment: Shunt Jumper)
JMP77  Manufacturer Part No.: S1002-OPS60-01G  (hidden comment: Shunt Jumper)
JMP78  Manufacturer Part No.: S1002-OPS60-01G  (hidden comment: Shunt Jumper)
JMP79  Manufacturer Part No.: S1002-OPS60-01G  (hidden comment: Shunt Jumper)
JMP80  Manufacturer Part No.: S1002-OPS60-01G  (hidden comment: Shunt Jumper)
JMP81  Manufacturer Part No.: S1002-OPS60-01G  (hidden comment: Shunt Jumper)
JMP82  Manufacturer Part No.: S1002-OPS60-01G  (hidden comment: Shunt Jumper)
JMP83  Manufacturer Part No.: S1002-OPS60-01G  (hidden comment: Shunt Jumper)
JMP84  Manufacturer Part No.: S1002-OPS60-01G  (hidden comment: Shunt Jumper)
JMP85  Manufacturer Part No.: S1002-OPS60-01G  (hidden comment: Shunt Jumper)
JMP86  Manufacturer Part No.: S1002-OPS60-01G  (hidden comment: Shunt Jumper)
JMP87  Manufacturer Part No.: S1002-OPS60-01G  (hidden comment: Shunt Jumper)
JMP88  Manufacturer Part No.: S1002-OPS60-01G  (hidden comment: Shunt Jumper)
JMP89  Manufacturer Part No.: S1002-OPS60-01G  (hidden comment: Shunt Jumper)
JMP90  Manufacturer Part No.: S1002-OPS60-01G  (hidden comment: Shunt Jumper)
JMP91  Manufacturer Part No.: S1002-OPS60-01G  (hidden comment: Shunt Jumper)
JMP92  Manufacturer Part No.: S1002-OPS60-01G  (hidden comment: Shunt Jumper)
JMP93  Manufacturer Part No.: S1002-OPS60-01G  (hidden comment: Shunt Jumper)
JMP94  Manufacturer Part No.: S1002-OPS60-01G  (hidden comment: Shunt Jumper)
JMP95  Manufacturer Part No.: S1002-OPS60-01G  (hidden comment: Shunt Jumper)
JMP96  Manufacturer Part No.: S1002-OPS60-01G  (hidden comment: Shunt Jumper)
JMP97  Manufacturer Part No.: S1002-OPS60-01G  (hidden comment: Shunt Jumper)
JMP98  Manufacturer Part No.: S1002-OPS60-01G  (hidden comment: Shunt Jumper)
JMP99  Manufacturer Part No.: S1002-OPS60-01G  (hidden comment: Shunt Jumper)
JMP100  Manufacturer Part No.: S1002-OPS60-01G  (hidden comment: Shunt Jumper)
JMP101  Manufacturer Part No.: S1002-OPS60-01G  (hidden comment: Shunt Jumper)
JMP102  Manufacturer Part No.: S1002-OPS60-01G  (hidden comment: Shunt Jumper)
JMP103  Manufacturer Part No.: S1002-OPS60-01G  (hidden comment: Shunt Jumper)
JMP104  Manufacturer Part No.: S1002-OPS60-01G  (hidden comment: Shunt Jumper)
JMP105  Manufacturer Part No.: S1002-OPS60-01G  (hidden comment: Shunt Jumper)
JMP106  Manufacturer Part No.: S1002-OPS60-01G  (hidden comment: Shunt Jumper)
JMP107  Manufacturer Part No.: S1002-OPS60-01G  (hidden comment: Shunt Jumper)
JMP108  Manufacturer Part No.: S1002-OPS60-01G  (hidden comment: Shunt Jumper)
JMP109  Manufacturer Part No.: S1002-OPS60-01G  (hidden comment: Shunt Jumper)
JMP110  Manufacturer Part No.: S1002-OPS60-01G  (hidden comment: Shunt Jumper)
JMP111  Manufacturer Part No.: S1002-OPS60-01G  (hidden comment: Shunt Jumper)
JMP112  Manufacturer Part No.: S1002-OPS60-01G  (hidden comment: Shunt Jumper)
JMP113  Manufacturer Part No.: S1002-OPS60-01G  (hidden comment: Shunt Jumper)
JMP114  Manufacturer Part No.: S1002-OPS60-01G  (hidden comment: Shunt Jumper)
JMP115  Manufacturer Part No.: S1002-OPS60-01G  (hidden comment: Shunt Jumper)
JMP116  Manufacturer Part No.: S1002-OPS60-01G  (hidden comment: Shunt Jumper)
JMP117  Manufacturer Part No.: S1002-OPS60-01G  (hidden comment: Shunt Jumper)
JMP118  Manufacturer Part No.: S1002-OPS60-01G  (hidden comment: Shunt Jumper)
JMP119  Manufacturer Part No.: S1002-OPS60-01G  (hidden comment: Shunt Jumper)
JMP120  Manufacturer Part No.: S1002-OPS60-01G  (hidden comment: Shunt Jumper)
JMP121  Manufacturer Part No.: S1002-OPS60-01G  (hidden comment: Shunt Jumper)
JMP122  Manufacturer Part No.: S1002-OPS60-01G  (hidden comment: Shunt Jumper)
JMP123  Manufacturer Part No.: S1002-OPS60-01G  (hidden comment: Shunt Jumper)
JMP124  Manufacturer Part No.: S1002-OPS60-01G  (hidden comment: Shunt Jumper)
JMP125  Manufacturer Part No.: S1002-OPS60-01G  (hidden comment: Shunt Jumper)
JMP126  Manufacturer Part No.: S1002-OPS60-01G  (hidden comment: Shunt Jumper)
JMP127  Manufacturer Part No.: S1002-OPS60-01G  (hidden comment: Shunt Jumper)
JMP128  Manufacturer Part No.: S1002-OPS60-01G  (hidden comment: Shunt Jumper)
JMP129  Manufacturer Part No.: S1002-OPS60-01G  (hidden comment: Shunt Jumper)
JMP130  Manufacturer Part No.: S1002-OPS60-01G  (hidden comment: Shunt Jumper)
JMP131  Manufacturer Part No.: S1002-OPS60-01G  (hidden comment: Shunt Jumper)
JMP132  Manufacturer Part No.: S1002-OPS60-01G  (hidden comment: Shunt Jumper)
JMP133  Manufacturer Part No.: S1002-OPS60-01G  (hidden comment: Shunt Jumper)
JMP134  Manufacturer Part No.: S1002-OPS60-01G  (hidden comment: Shunt Jumper)
JMP135  Manufacturer Part No.: S1002-OPS60-01G  (hidden comment: Shunt Jumper)
JMP136  Manufacturer Part No.: S1002-OPS60-01G  (hidden comment: Shunt Jumper)
JMP137  Manufacturer Part No.: S1002-OPS60-01G  (hidden comment: Shunt Jumper)
JMP138  Manufacturer Part No.: S1002-OPS60-01G  (hidden comment: Shunt Jumper)
JMP139  Manufacturer Part No.: S1002-OPS60-01G  (hidden comment: Shunt Jumper)
JMP140  Manufacturer Part No.: S1002-OPS60-01G  (hidden comment: Shunt Jumper)
JMP141  Manufacturer Part No.: S1002-OPS60-01G  (hidden comment: Shunt Jumper)
JMP142  Manufacturer Part No.: S1002-OPS60-01G  (hidden comment: Shunt Jumper)
JMP143  Manufacturer Part No.: S1002-OPS60-01G  (hidden comment: Shunt Jumper)
JMP144  Manufacturer Part No.: S1002-OPS60-01G  (hidden comment: Shunt Jumper)
JMP145  Manufacturer Part No.: S1002-OPS60-01G  (hidden comment: Shunt Jumper)
JMP146  Manufacturer Part No.: S1002-OPS60-01G  (hidden comment: Shunt Jumper)
JMP147  Manufacturer Part No.: S1002-OPS60-01G  (hidden comment: Shunt Jumper)
JMP148  Manufacturer Part No.: S1002-OPS60-01G  (hidden comment: Shunt Jumper)
MECH1  Manufacturer Part No.: 48099-5701  [T_Molex_48099-5701_MECH]  (hidden comment: MECH-Mini-PCIe Latch)
MECH2  MECH-Toradex_Logo  [T_TORADEX_LOGO]  (value not drawn)  (no BOM)
MECH3  MECH-Fiducial  [T_Fiducial]  (value not drawn)  (no BOM)
MECH4  MECH-Fiducial  [T_Fiducial]  (value not drawn)  (no BOM)
MECH5  MECH-Fiducial  [T_Fiducial]  (value not drawn)  (no BOM)
MECH6  MECH-Fiducial  [T_Fiducial]  (value not drawn)  (no BOM)
MECH7  MECH-Fiducial  [T_Fiducial]  (value not drawn)  (no BOM)
MECH8  MECH-Fiducial  [T_Fiducial]  (value not drawn)  (no BOM)
MECH9  Manufacturer Part No.: 48099-5701  [T_Molex_48099-5701_MECH]  (hidden comment: MECH-Mini-PCIe Latch)
MECH10  Manufacturer Part No.: 48099-5701  [T_Molex_48099-5701_MECH]  (hidden comment: MECH-Mini-PCIe Latch)
MECH11  KFE-M3-3ET
MECH12  KFE-M3-3ET
MECH13  KFE-M3-3ET
MECH14  KFE-M3-8ET
MECH15  KFE-M3-8ET
MECH16  KFE-M3-8ET
MECH17  KFE-M3-8ET
MECH18  KFE-M3-8ET
MECH19  KFE-M3-8ET
MECH20  MECH-Fiducial  [T_Fiducial]  (value not drawn)  (no BOM)
MECH21  MECH-Fiducial  [T_Fiducial]  (value not drawn)  (no BOM)
MECH22  M3-4N  (value not drawn)
MECH23  M3-4N  (value not drawn)
MECH24  M3-4N  (value not drawn)
MECH25  M3-4N  (value not drawn)
MECH27  HP-6  (value not drawn)
MECH28  HP-6  (value not drawn)
MECH29  HP-6  (value not drawn)
MECH30  HP-6  (value not drawn)
MECH32  MECH-Fiducial  [T_Fiducial]  (value not drawn)  (no BOM)
MECH33  MECH-Fiducial  [T_Fiducial]  (value not drawn)  (no BOM)
MECH34  MECH-Fiducial  [T_Fiducial]  (value not drawn)  (no BOM)
MECH35  MECH-TypeSpecific  [T_TYPE_SPECIFIC]  (value not drawn)  (no BOM)
MECH36  Manufacturer Part No.: 48099-5701  [T_Molex_48099-5701_MECH]  (hidden comment: MECH-Mini-PCIe Latch)
MECH37  Manufacturer Part No.: 48099-5701  [T_Molex_48099-5701_MECH]  (hidden comment: MECH-Mini-PCIe Latch)
MECH100  MC100-508-02
PCB1  PCB Apalis EvalBoard V1.1.001  (value not drawn)

### Notes on the sheet
- (near MECH100) Power supply connector mate
- Title
- Size:
- Date:
- A3
- Number:
- Time:
- Revision:
- Sheet
- of
- File:
- (in symbol MECH-HiTech-KFE-M3-3ET) Spacer
- (in symbol MECH-HiTech-KFE-M3-8ET) Spacer
- (in symbol MECH-Molex-48099-5701) Mini PCIe Latch
- (in symbol MECH-Toradex_Logo) Toradex Logo
- (in symbol MECH-TypeSpecific) Type Specific Board

### Library data of the parts
JMP1-JMP148 = MECH-Shunt-Jumper-Black-2.54mm: Manufacturer Name: JVE
MECH1 MECH9 MECH10 MECH36 MECH37 = MECH-Molex-48099-5701: Mini-PCIe Latch; Manufacturer Name: Molex
MECH2 = MECH-Toradex_Logo: Toradex_Logo
MECH3-MECH8 MECH20 MECH21 MECH32-MECH34 = MECH-Fiducial: Fiducial
MECH11-MECH13 = MECH-HiTech-KFE-M3-3ET: Spacer 3mm M3; Manufacturer Name: Hi-Tech Fasteners Inc; Manufacturer Part No.: KFE-M3-3ET
MECH14-MECH19 = MECH-HiTech-KFE-M3-8ET: Spacer 8mm M3; Manufacturer Name: Hi-Tech Fasteners Inc; Manufacturer Part No.: KFE-M3-8ET
MECH22-MECH25 = MECH-KangYang-M3-4N: Plastic Tapping Screw M3x4mm/-; Manufacturer Name: Kang Yang; Manufacturer Part No.: M3-4N
MECH27-MECH30 = MECH-KangYang-HP-6: Plastic Hexagonal Spacer 6 mm/-/-; Manufacturer Name: Kang Yang; Manufacturer Part No.: HP-6
MECH35 = MECH-TypeSpecific: PCB Structure
MECH100 = CON-DECA-MC100-508-02-1x2-Mate: Power Connector Mate; Manufacturer Name: DECA Switchlab; No. of ways: 1x2; Pitch: 5.08mm; Manufacturer Part No.: MC100-508-02
PCB1 = PCB Apalis EvalBoard V1.1.001: PCB Structure

## Sheet DDC.SchDoc: Apalis Evaluation Board 1.1
size A3; Organization: Toradex AG; Address1: Altsagenstrasse 5; Address2: Horw; Address3: 6048; Address4: Switzerland; DocumentNumber: 19; Revision: V1.1; SheetNumber: 19; SheetTotal: 32; PageSetup: Record=PageOptions|CenterHorizontal=True|CenterVertical=True|PrintScale=0.71|XCorrection=1.00|YCorrection=1.00|PrintKind=0|BorderSize=5000000|LeftOffset=0|BottomOffset=0|Orientation=2|PaperLength=1000|PaperWidth=1000|Scale=100|PaperSource=7|PrintQuality=-4|MediaType=1|DitherType=10|PaperKind=A4|PrintScaleMode=1
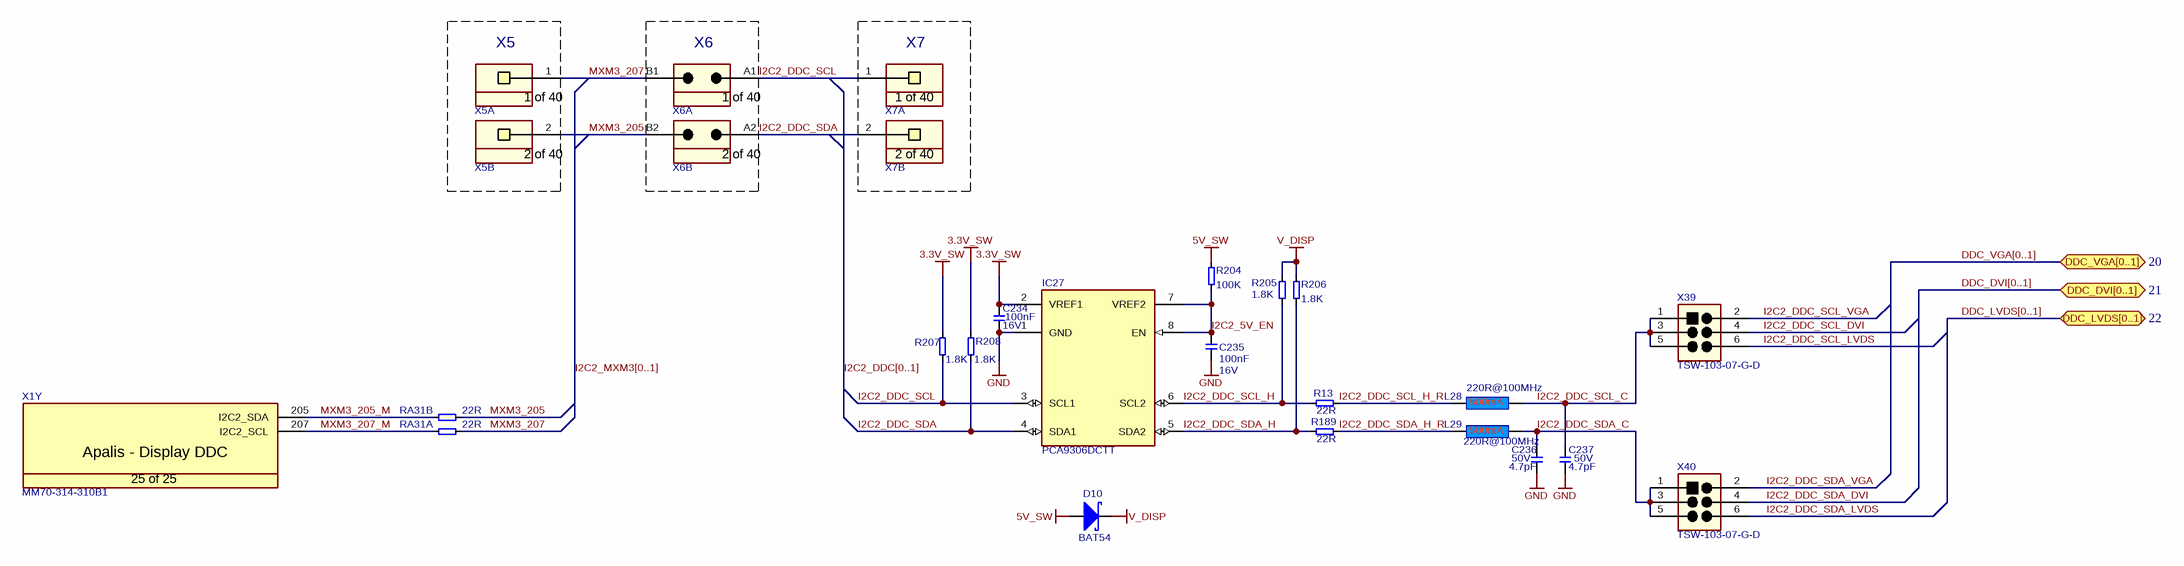
[diagram p24: DDC.SchDoc]

### Parts
C234  Rating: 16V  [T_CAPC0603X33N]  (hidden comment: 100nF)
C235  Rating: 16V  [T_CAPC0603X33N]  (hidden comment: 100nF)
C236  Rating: 50V  [T_CAPC0603X33N]  (hidden comment: 4.7pF)
C237  Rating: 50V  [T_CAPC0603X33N]  (hidden comment: 4.7pF)
D10  BAT54  [SOT95P230X110-3N]
IC27  PCA9306DCTT  [T_TI_PCA9306DCTT]
L28  220R@100MHz  [INDC1608X95N]
L29  220R@100MHz  [INDC1608X95N]
R13  22R  [T_RESC0603X30N]
R189  22R  [T_RESC0603X30N]
R204  100K  [T_RESC0603X30N]
R205  1.8K  [T_RESC0603X30N]
R206  1.8K  [T_RESC0603X30N]
R207  1.8K  [T_RESC0603X30N]
R208  1.8K  [T_RESC0603X30N]
RA31  22R  [T_Resistor_Array_X4]  (parts A,B of 4)
X1  Manufacturer Part No.: MM70-314-310B1  [T_JAE_MM70-314-310B1]  (hidden comment: CON-JAE-MM70-314-310B1-314-0.5mm)  (part Y of 25)
X5  SSW-110-01-G-S  [T_Samtec_SSW-110-01-G-S]  (value not drawn)  (parts A,B of 40)
X6  TSW-110-07-G-D  [T_Samtec_TSW-110-07-G-D]  (value not drawn)  (parts A,B of 40)
X7  SSW-110-01-G-S  [T_Samtec_SSW-110-01-G-S]  (value not drawn)  (parts A,B of 40)
X39  TSW-103-07-G-D  [T_Samtec_TSW-103-07-G-D]
X40  TSW-103-07-G-D  [T_Samtec_TSW-103-07-G-D]

### Blocks framed on the sheet
X5: X5
X6: X6
X7: X7

### Ports
DDC_DVI[0..1] (bidir, see 21), DDC_LVDS[0..1] (bidir, see 22), DDC_VGA[0..1] (bidir, see 20)

### Nets
3.3V_SW: C234.2 IC27.2(VREF1) R207.2 R208.2
5V_SW: D10.1 R204.2
GND: C234.1 C235.1 C236.2 C237.2 IC27.1(GND)
V_DISP: D10.3 R205.1 R206.1
I2C2_5V_EN: C235.2 IC27.7(VREF2) IC27.8(EN) R204.1
I2C2_DDC_SCL: IC27.3(SCL1) R207.1 X6.A1 X7.1
I2C2_DDC_SCL_C: C237.1 L28.2 X39.1 X39.3 X39.5
I2C2_DDC_SCL_DVI: X39.4
I2C2_DDC_SCL_H: IC27.6(SCL2) R13.1 R205.2
I2C2_DDC_SCL_H_R: L28.1 R13.2
I2C2_DDC_SCL_LVDS: X39.6
I2C2_DDC_SCL_VGA: X39.2
I2C2_DDC_SDA: IC27.4(SDA1) R208.1 X6.A2 X7.2
I2C2_DDC_SDA_C: C236.1 L29.2 X40.1 X40.3 X40.5
I2C2_DDC_SDA_DVI: X40.4
I2C2_DDC_SDA_H: IC27.5(SDA2) R189.1 R206.2
I2C2_DDC_SDA_H_R: L29.1 R189.2
I2C2_DDC_SDA_LVDS: X40.6
I2C2_DDC_SDA_VGA: X40.2
MXM3_205: RA31.6 X5.2 X6.B2
MXM3_205_M: RA31.2 X1.205(I2C2_SDA)
MXM3_207: RA31.5 X5.1 X6.B1
MXM3_207_M: RA31.1 X1.207(I2C2_SCL)

### Buses and harness runs
bus DDC_DVI[0..1] = port DDC_DVI[0..1]
bus DDC_LVDS[0..1] = port DDC_LVDS[0..1]
bus DDC_VGA[0..1] = port DDC_VGA[0..1]
bus I2C2_DDC[0..1]
bus I2C2_MXM3[0..1]

### Notes on the sheet
- Title
- Size:
- Date:
- A3
- Number:
- Time:
- Revision:
- Sheet
- of
- File:
- (in symbol CON-JAE-MM70-314-310B1-314-0.5mm, part Y) Apalis - Display DDC; 25 of 25
- (in symbol CON-Samtec-SSW-110-01-G-S, part A) 1 of 40
- (in symbol CON-Samtec-SSW-110-01-G-S, part B) 2 of 40
- (in symbol CON-Samtec-TSW-110-07-G-D, part A) 1 of 40
- (in symbol CON-Samtec-TSW-110-07-G-D, part B) 2 of 40

### Library data of the parts
C234 C235 = C-X7R-100nF-16V-10%-0603: Capacitor Ceramic X7R 100nF 16V 10% 0603; Tolerance: 10%; Type: X7R; Value: 100nF
C236 C237 = C-NP0-4.7pF-25V-10%-0603: Capacitor Ceramic NP0  4.7pF 25V 10% 0603; Tolerance: 10%; Type: NP0; Value: 4.7pF
D10 = D-Philips-BAT54-Schottky: BAT54 Schottky Diode; Manufacturer Name: Philips; Manufacturer Part No.: BAT54
IC27 = IC-TI-PCA9306DCTT: Dual Bidirectional I2C and SMBus Voltage-Level Translator; Manufacturer Name: Texas Instruments; Manufacturer Part No.: PCA9306DCTT
L28 L29 = L-220R@100MHz-500mA-25%-0603: 220R@100MHz 500mA EMI FILTER; Tolerance: 25%; Rating: 500mA; Value: 220R@100MHz
R13 R189 = R-22R-63mW-5%-0603: Resistor 22 ohm 63mW 5% 0603; Rating: 63mW; Tolerance: 5%; Value: 22R
R204 = R-100KR-63mW-5%-0603: Resistor 100 Kohm 63mW 5% 0603; Value: 100KR; Rating: 63mW; Tolerance: 5%
R205-R208 = R-1.8KR-63mW-5%-0603: Resistor 1.8 Kohm 63mW 5% 0603; Value: 1.8KR; Rating: 63mW; Tolerance: 5%
RA31 = RA-22R-63mW-5%-1206-div: Resistor Array 22 R 63mW 5% 1206; Tolerance: 5%; Power Dissipation: 63mW; Value: 22R
X1 = CON-JAE-MM70-314-310B1-314-0.5mm: MXM3 Connector; Manufacturer Name: JAE; No. of ways: 314
X5 X7 = CON-Samtec-SSW-110-01-G-S: Receptacle Female Socket 1x40 pin 2.54mm pitch; Manufacturer Name: Samtec; Pitch: 2.54mm; No. of ways: 1x40; Manufacturer Part No.: SSW-110-01-G-S
X6 = CON-Samtec-TSW-110-07-G-D: Header 2x40 pin 2.54mm pitch; Manufacturer Name: Samtec; Pitch: 2.54mm; No. of ways: 2x40; Manufacturer Part No.: TSW-110-07-G-D
X39 X40 = CON-Samtec-TSW-103-07-G-D-SIM: Header Male, 2x3 Pins, 2.54mm pitch; Manufacturer Name: Samtec; No. of. ways: 2x3; Pitch: 2.54mm; Manufacturer Part No.: TSW-103-07-G-D

## Sheet VGA.SchDoc: Apalis Evaluation Board 1.1
size A3; Organization: Toradex AG; Address1: Altsagenstrasse 5; Address2: Horw; Address3: 6048; Address4: Switzerland; DocumentNumber: 20; Revision: V1.1; SheetNumber: 20; SheetTotal: 32; PageSetup: Record=PageOptions|CenterHorizontal=True|CenterVertical=True|PrintScale=0.73|XCorrection=1.00|YCorrection=1.00|PrintKind=0|BorderSize=5000000|LeftOffset=0|BottomOffset=0|Orientation=2|PaperLength=1000|PaperWidth=1000|Scale=100|PaperSource=7|PrintQuality=-4|MediaType=1|DitherType=10|PaperKind=A4|PrintScaleMode=1
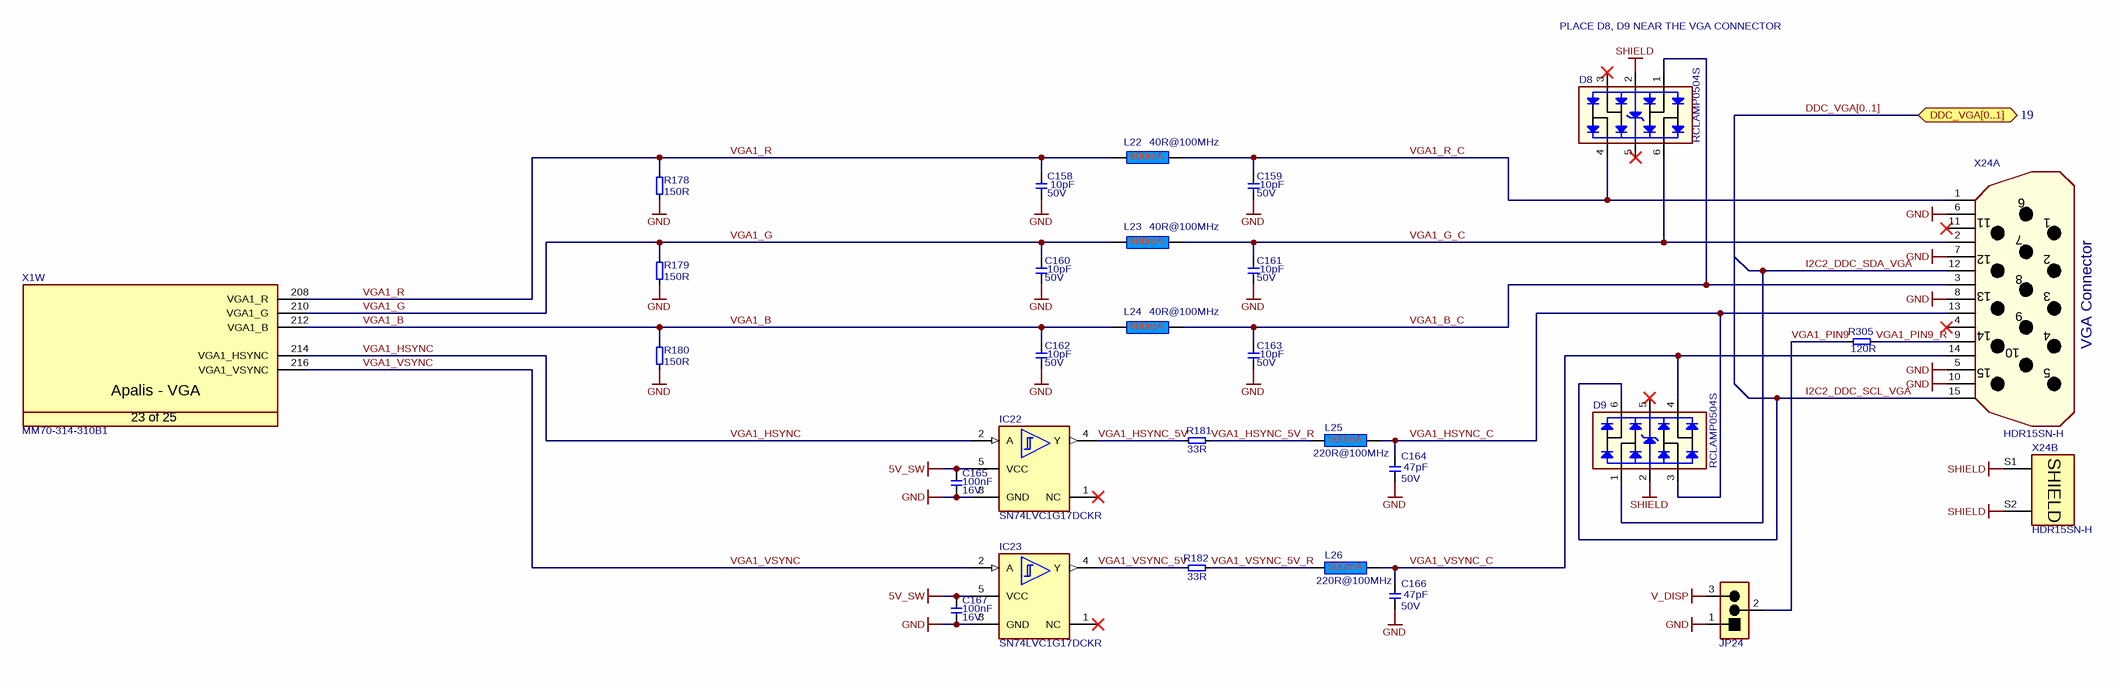
[diagram p25: VGA.SchDoc]

### Parts
C158  Rating: 50V  [T_CAPC0603X33N]  (hidden comment: 10pF)
C159  Rating: 50V  [T_CAPC0603X33N]  (hidden comment: 10pF)
C160  Rating: 50V  [T_CAPC0603X33N]  (hidden comment: 10pF)
C161  Rating: 50V  [T_CAPC0603X33N]  (hidden comment: 10pF)
C162  Rating: 50V  [T_CAPC0603X33N]  (hidden comment: 10pF)
C163  Rating: 50V  [T_CAPC0603X33N]  (hidden comment: 10pF)
C164  Rating: 50V  [T_CAPC0603X33N]  (hidden comment: 47pF)
C165  Rating: 16V  [T_CAPC0603X33N]  (hidden comment: 100nF)
C166  Rating: 50V  [T_CAPC0603X33N]  (hidden comment: 47pF)
C167  Rating: 16V  [T_CAPC0603X33N]  (hidden comment: 100nF)
D8  RCLAMP0504S  [T_SOT95P285X90-6N]
D9  RCLAMP0504S  [T_SOT95P285X90-6N]
IC22  SN74LVC1G17DCKR  [SOT65P210X110-5N]
IC23  SN74LVC1G17DCKR  [SOT65P210X110-5N]
JP24  826936-3  [T_TYCO_826936-3]  (value not drawn)
L22  40R@100MHz  [INDC1608X95N]
L23  40R@100MHz  [INDC1608X95N]
L24  40R@100MHz  [INDC1608X95N]
L25  220R@100MHz  [INDC1608X95N]
L26  220R@100MHz  [INDC1608X95N]
R178  150R  [T_RESC0603X30N]
R179  150R  [T_RESC0603X30N]
R180  150R  [T_RESC0603X30N]
R181  33R  [t_RESC0603X30N]
R182  33R  [t_RESC0603X30N]
R305  120R  [T_RESC0603X30N]
X1  Manufacturer Part No.: MM70-314-310B1  [T_JAE_MM70-314-310B1]  (hidden comment: CON-JAE-MM70-314-310B1-314-0.5mm)  (part W of 25)
X24  HDR15SN-H  [T_AUK_HDR15SN-H]  (parts A,B of 2)

### Ports
DDC_VGA[0..1] (bidir, see 19)

### Nets
5V_SW: C165.2 C167.2 IC22.5(VCC) IC23.5(VCC)
GND: C158.2 C159.2 C160.2 C161.2 C162.2 C163.2 C164.2 C165.1 C166.2 C167.1 IC22.3(GND) IC23.3(GND) JP24.1 R178.1 R179.1 R180.1 X24.5(GND) X24.6(DSR) X24.7(RTS) X24.8(CTS) X24.10(RI)
SHIELD: D8.2 D9.2 X24.S1(SHIELD) X24.S2(SHIELD)
V_DISP: JP24.3
I2C2_DDC_SCL_VGA: D9.6 X24.15(RI)
I2C2_DDC_SDA_VGA: D9.1 X24.12(RI)
VGA1_B: C162.1 L24.1 R180.2 X1.212(VGA1_B)
VGA1_B_C: C163.1 D8.1 L24.2 X24.3(TXD)
VGA1_G: C160.1 L23.1 R179.2 X1.210(VGA1_G)
VGA1_G_C: C161.1 D8.6 L23.2 X24.2(RXD)
VGA1_HSYNC: IC22.2(A) X1.214(VGA1_HSYNC)
VGA1_HSYNC_5V: IC22.4(Y) R181.1
VGA1_HSYNC_5V_R: L25.1 R181.2
VGA1_HSYNC_C: C164.1 D9.3 L25.2 X24.13(RI)
VGA1_PIN9: JP24.2 R305.1
VGA1_PIN9_R: R305.2 X24.9(RI)
VGA1_R: C158.1 L22.1 R178.2 X1.208(VGA1_R)
VGA1_R_C: C159.1 D8.4 L22.2 X24.1(DCD)
VGA1_VSYNC: IC23.2(A) X1.216(VGA1_VSYNC)
VGA1_VSYNC_5V: IC23.4(Y) R182.1
VGA1_VSYNC_5V_R: L26.1 R182.2
VGA1_VSYNC_C: C166.1 D9.4 L26.2 X24.14(RI)

Not connected (* = marked no-connect by the designer): D8 3* 5*; D9 5*; IC22 1(NC)*; IC23 1(NC)*; X24 4(DTR)* 11(RI)*

### Buses and harness runs
bus DDC_VGA[0..1] = port DDC_VGA[0..1]

### Notes on the sheet
- (near D8) PLACE D8, D9 NEAR THE VGA CONNECTOR
- VGA Connector
- Title
- Size:
- Date:
- A3
- Number:
- Time:
- Revision:
- Sheet
- of
- File:
- (in symbol CON-JAE-MM70-314-310B1-314-0.5mm, part W) Apalis - VGA; 23 of 25

### Library data of the parts
C158-C163 = C-NP0-10pF-50V-10%-0603: Capacitor Ceramic NP0 10pF 50V 10% 0603; Tolerance: 10%; Type: NP0; Value: 10pF
C164 C166 = C-NP0-47pF-50V-10%-0603: Capacitor Ceramic NP0 47pF 50V 10% 0603; Tolerance: 10%; Type: NP0; Value: 47pF
C165 C167 = C-X7R-100nF-16V-10%-0603: Capacitor Ceramic X7R 100nF 16V 10% 0603; Tolerance: 10%; Type: X7R; Value: 100nF
D8 D9 = D-Semtech-RClamp0504S: TVS Array low cap; Manufacturer Name: Semtech; Manufacturer Part No.: RCLAMP0504S
IC22 IC23 = IC-TI-SN74LVC1G17DCKR: Single Schmitt-Trigger Buffer; Manufacturer Name: Texas Instruments; Manufacturer Part No.: SN74LVC1G17DCKR
JP24 = CON-Tyco-826936-3-1X3-2.54mm-JP_1: Jumper, 3-Pin; Manufacturer Name: Tyco; No. of ways: 1X3; Pitch: 2.54mm; Manufacturer Part No.: 826936-3
L22-L24 = L-TDK-MMZ1608S400A-40R@100MHz-600mA-25%-0603: 40R@100MHz 600mA EMI FILTER; Manufacturer Name: TDK; Tolerance: 25%; Rating: 600mA; Manufacturer Part No.: MMZ1608S400A; Value: 40R@100MHz
L25 L26 = L-220R@100MHz-500mA-25%-0603: as L28 on sheet DDC; Rating: 500mA; Value: 220R@100MHz
R178-R180 = R-150R-63mW-1%-0603: Resistor 150 ohm 63mW 1% 0603; Rating: 63mW; Tolerance: 1%; Value: 150R
R181 R182 = R-33R-63mW-5%-0603: Resistor 33 ohm 63mW 5% 0603; Rating: 63mW; Tolerance: 5%; Value: 33R
R305 = R-120R-250mW-5%-0603: Resistor 120 ohm 250mW 5% 0603; Rating: 250mW; Tolerance: 5%; Value: 120R
X1 = CON-JAE-MM70-314-310B1-314-0.5mm: as X1 on sheet DDC
X24 = CON-AUK-HDR15SN-H: 15 pin male D-SUB connector; Manufacturer Name: AUK; No. of ways: 15; Manufacturer Part No.: HDR15SN-H

## Sheet LVDS.SchDoc: Apalis Evaluation Board 1.1
size A3; Organization: Toradex AG; Address1: Altsagenstrasse 5; Address2: Horw; Address3: 6048; Address4: Switzerland; DocumentNumber: 22; Revision: V1.1; SheetNumber: 22; SheetTotal: 32; PageSetup: Record=PageOptions|CenterHorizontal=True|CenterVertical=True|PrintScale=0.73|XCorrection=1.00|YCorrection=1.00|PrintKind=0|BorderSize=5000000|LeftOffset=0|BottomOffset=0|Orientation=2|PaperLength=1000|PaperWidth=1000|Scale=100|PaperSource=7|PrintQuality=-4|MediaType=1|DitherType=10|PaperKind=A4|PrintScaleMode=1
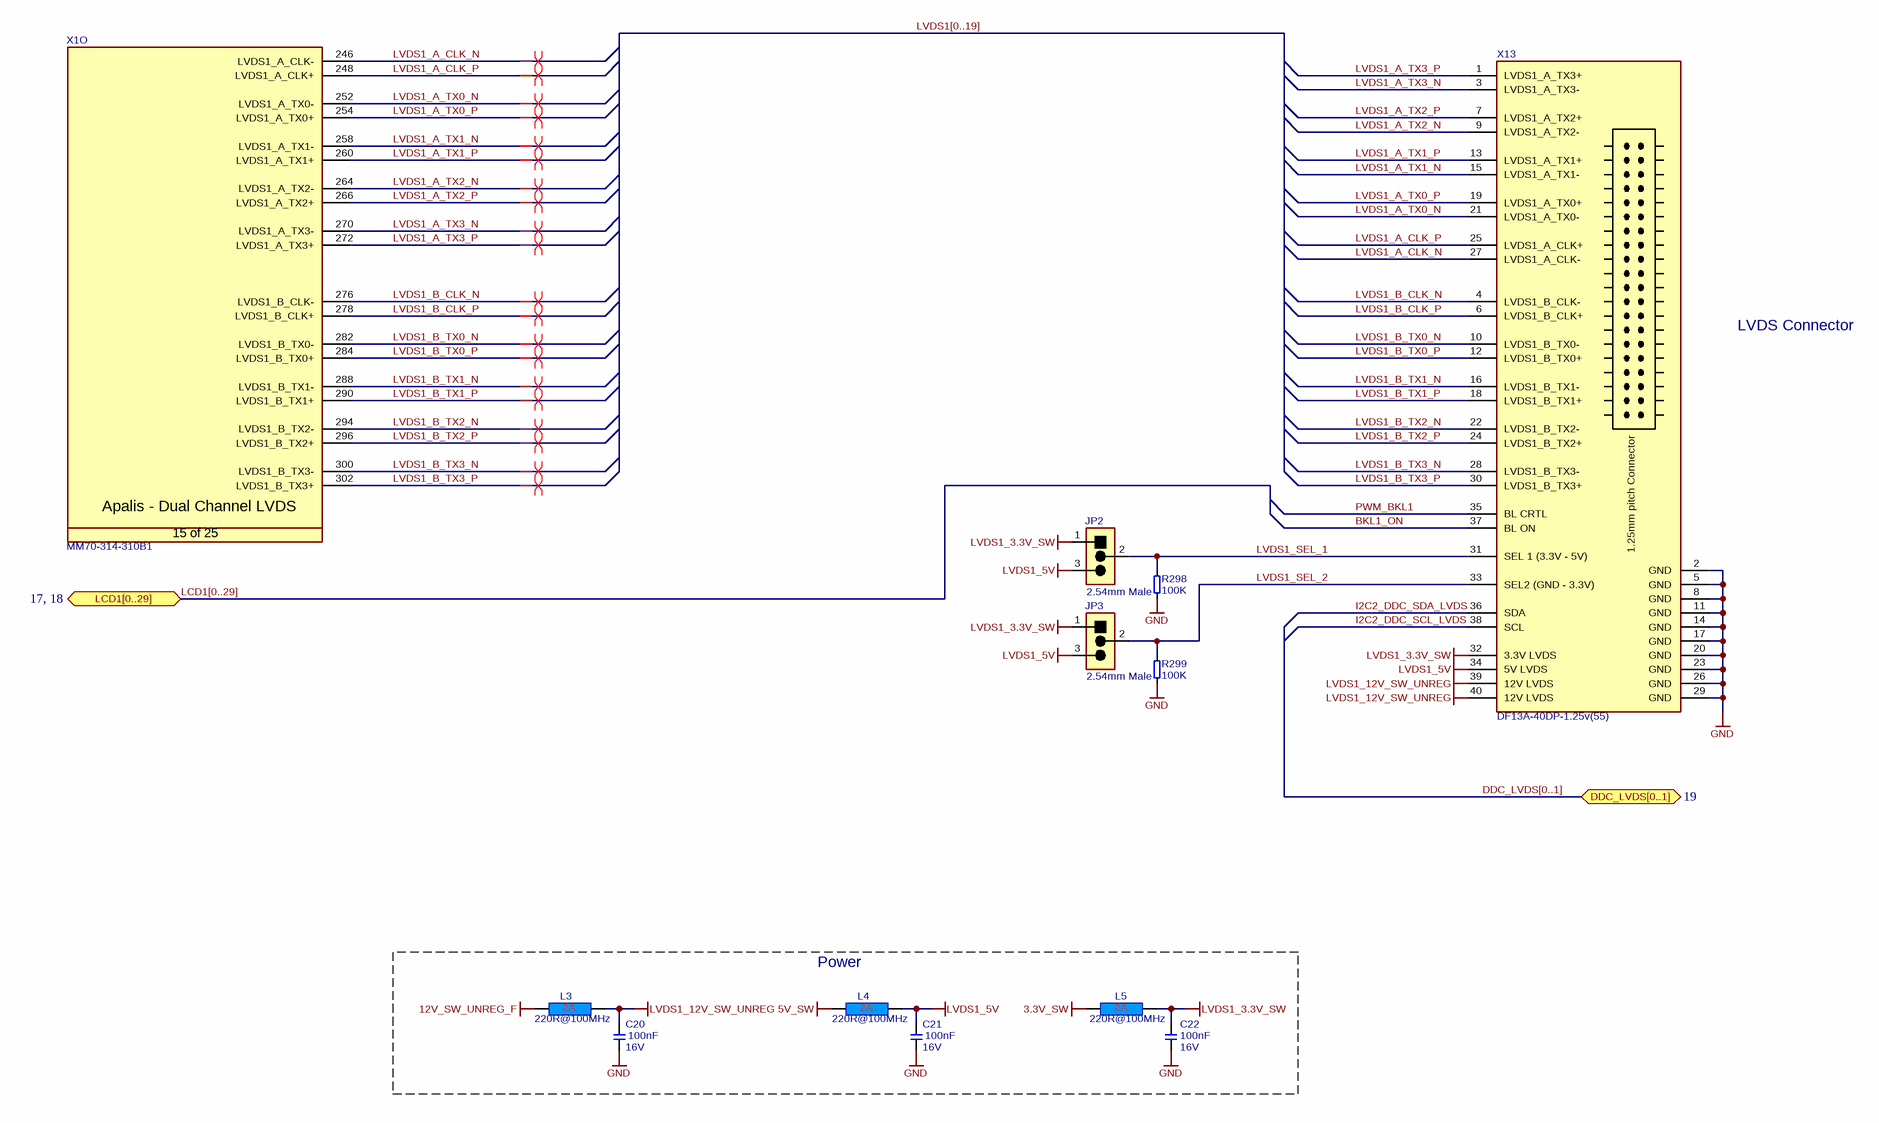
[diagram p26: LVDS.SchDoc]

### Parts
C20  Rating: 16V  [T_CAPC0603X33N]  (hidden comment: 100nF)
C21  Rating: 16V  [T_CAPC0603X33N]  (hidden comment: 100nF)
C22  Rating: 16V  [T_CAPC0603X33N]  (hidden comment: 100nF)
JP2  826936-3  [T_TYCO_826936-3]  (value not drawn)
JP3  826936-3  [T_TYCO_826936-3]  (value not drawn)
L3  220R@100MHz  [INDC1608X95N]
L4  220R@100MHz  [INDC1608X95N]
L5  220R@100MHz  [INDC1608X95N]
R298  100K  [T_RESC0603X30N]
R299  100K  [T_RESC0603X30N]
X1  Manufacturer Part No.: MM70-314-310B1  [T_JAE_MM70-314-310B1]  (hidden comment: CON-JAE-MM70-314-310B1-314-0.5mm)  (part O of 25)
X13  Manufacturer Part No.: DF13A-40DP-1.25v(55)  [T_HIROSE_DF13A-40DP-1.25V(55)]  (hidden comment: CON-Hirose-DF13A-40DP-1.25v(55)-2x10-1mm)

### Blocks framed on the sheet
Power: C20-C22 L3-L5

### Ports
DDC_LVDS[0..1] (bidir, see 19), LCD1[0..29] (bidir, see 17, 18)

### Nets
3.3V_SW: L5.1
5V_SW: L4.1
12V_SW_UNREG_F: L3.1
GND: C20.1 C21.1 C22.1 R298.1 R299.1 X13.2(GND) X13.5(GND) X13.8(GND) X13.11(GND) X13.14(GND) X13.17(GND) X13.20(GND) X13.23(GND) X13.26(GND) X13.29(GND)
LVDS1_3.3V_SW: C22.2 JP2.1 JP3.1 L5.2 X13.32(3.3V_LVDS)
LVDS1_5V: C21.2 JP2.3 JP3.3 L4.2 X13.34(5V_LVDS)
LVDS1_12V_SW_UNREG: C20.2 L3.2 X13.39(12V_LVDS) X13.40(12V_LVDS)
BKL1_ON: X13.37(BL_ON)
I2C2_DDC_SCL_LVDS: X13.38(SCL)
I2C2_DDC_SDA_LVDS: X13.36(SDA)
LVDS1_A_CLK_N: X1.246(LVDS1_A_CLK-) X13.27(LVDS1_A_CLK-)
LVDS1_A_CLK_P: X1.248(LVDS1_A_CLK+) X13.25(LVDS1_A_CLK+)
LVDS1_A_TX0_N: X1.252(LVDS1_A_TX0-) X13.21(LVDS1_A_TX0-)
LVDS1_A_TX0_P: X1.254(LVDS1_A_TX0+) X13.19(LVDS1_A_TX0+)
LVDS1_A_TX1_N: X1.258(LVDS1_A_TX1-) X13.15(LVDS1_A_TX1-)
LVDS1_A_TX1_P: X1.260(LVDS1_A_TX1+) X13.13(LVDS1_A_TX1+)
LVDS1_A_TX2_N: X1.264(LVDS1_A_TX2-) X13.9(LVDS1_A_TX2-)
LVDS1_A_TX2_P: X1.266(LVDS1_A_TX2+) X13.7(LVDS1_A_TX2+)
LVDS1_A_TX3_N: X1.270(LVDS1_A_TX3-) X13.3(LVDS1_A_TX3-)
LVDS1_A_TX3_P: X1.272(LVDS1_A_TX3+) X13.1(LVDS1_A_TX3+)
LVDS1_B_CLK_N: X1.276(LVDS1_B_CLK-) X13.4(LVDS1_B_CLK-)
LVDS1_B_CLK_P: X1.278(LVDS1_B_CLK+) X13.6(LVDS1_B_CLK+)
LVDS1_B_TX0_N: X1.282(LVDS1_B_TX0-) X13.10(LVDS1_B_TX0-)
LVDS1_B_TX0_P: X1.284(LVDS1_B_TX0+) X13.12(LVDS1_B_TX0+)
LVDS1_B_TX1_N: X1.288(LVDS1_B_TX1-) X13.16(LVDS1_B_TX1-)
LVDS1_B_TX1_P: X1.290(LVDS1_B_TX1+) X13.18(LVDS1_B_TX1+)
LVDS1_B_TX2_N: X1.294(LVDS1_B_TX2-) X13.22(LVDS1_B_TX2-)
LVDS1_B_TX2_P: X1.296(LVDS1_B_TX2+) X13.24(LVDS1_B_TX2+)
LVDS1_B_TX3_N: X1.300(LVDS1_B_TX3-) X13.28(LVDS1_B_TX3-)
LVDS1_B_TX3_P: X1.302(LVDS1_B_TX3+) X13.30(LVDS1_B_TX3+)
LVDS1_SEL_1: JP2.2 R298.2 X13.31(SEL_1_(3.3V_-_5V))
LVDS1_SEL_2: JP3.2 R299.2 X13.33(SEL2_(GND_-_3.3V))
PWM_BKL1: X13.35(BL_CRTL)

### Buses and harness runs
bus DDC_LVDS[0..1] = port DDC_LVDS[0..1]
bus LCD1[0..29] = port LCD1[0..29]
bus LVDS1[0..19]

### Layout directives
differential pair: LVDS1_A_CLK_N, LVDS1_A_CLK_P, LVDS1_A_TX0_N, LVDS1_A_TX0_P, LVDS1_A_TX1_N, LVDS1_A_TX1_P, LVDS1_A_TX2_N, LVDS1_A_TX2_P, LVDS1_A_TX3_N, LVDS1_A_TX3_P, LVDS1_B_CLK_N, LVDS1_B_CLK_P, LVDS1_B_TX0_N, LVDS1_B_TX0_P, LVDS1_B_TX1_N, LVDS1_B_TX1_P, LVDS1_B_TX2_N, LVDS1_B_TX2_P, LVDS1_B_TX3_N, LVDS1_B_TX3_P

### Notes on the sheet
- (near X13) LVDS Connector
- 2.54mm Male
- Title
- Size:
- Date:
- A3
- Number:
- Time:
- Revision:
- Sheet
- of
- File:
- (in symbol CON-Hirose-DF13A-40DP-1.25v(55)-2x20-1.25mm) 1.25mm pitch Connector
- (in symbol CON-JAE-MM70-314-310B1-314-0.5mm, part O) Apalis - Dual Channel LVDS; 15 of 25

### Library data of the parts
C20-C22 = C-X7R-100nF-16V-10%-0603: Capacitor Ceramic X7R 100nF 16V 10% 0603; Tolerance: 10%; Type: X7R; Value: 100nF
JP2 JP3 = CON-Tyco-826936-3-1X3-2.54mm-JP: Jumper, 3-Pin; Manufacturer Name: Tyco; No. of ways: 1X3; Pitch: 2.54mm; Manufacturer Part No.: 826936-3
L3-L5 = L-220R@100MHz-2A-25%-0603: 220R@100MHz 2A EMI FILTER; Tolerance: 25%; Rating: 2A; Value: 220R@100MHz
R298 R299 = R-100KR-63mW-5%-0603: as R204 on sheet DDC; Rating: 63mW; Tolerance: 5%
X1 = CON-JAE-MM70-314-310B1-314-0.5mm: as X1 on sheet DDC
X13 = CON-Hirose-DF13A-40DP-1.25v(55)-2x20-1.25mm: LVDS Connector; Manufacturer Name: Hirose; No. of ways: 2x20; Pitch: 1.25mm